# Altium project MIS_Locker.PrjPCB
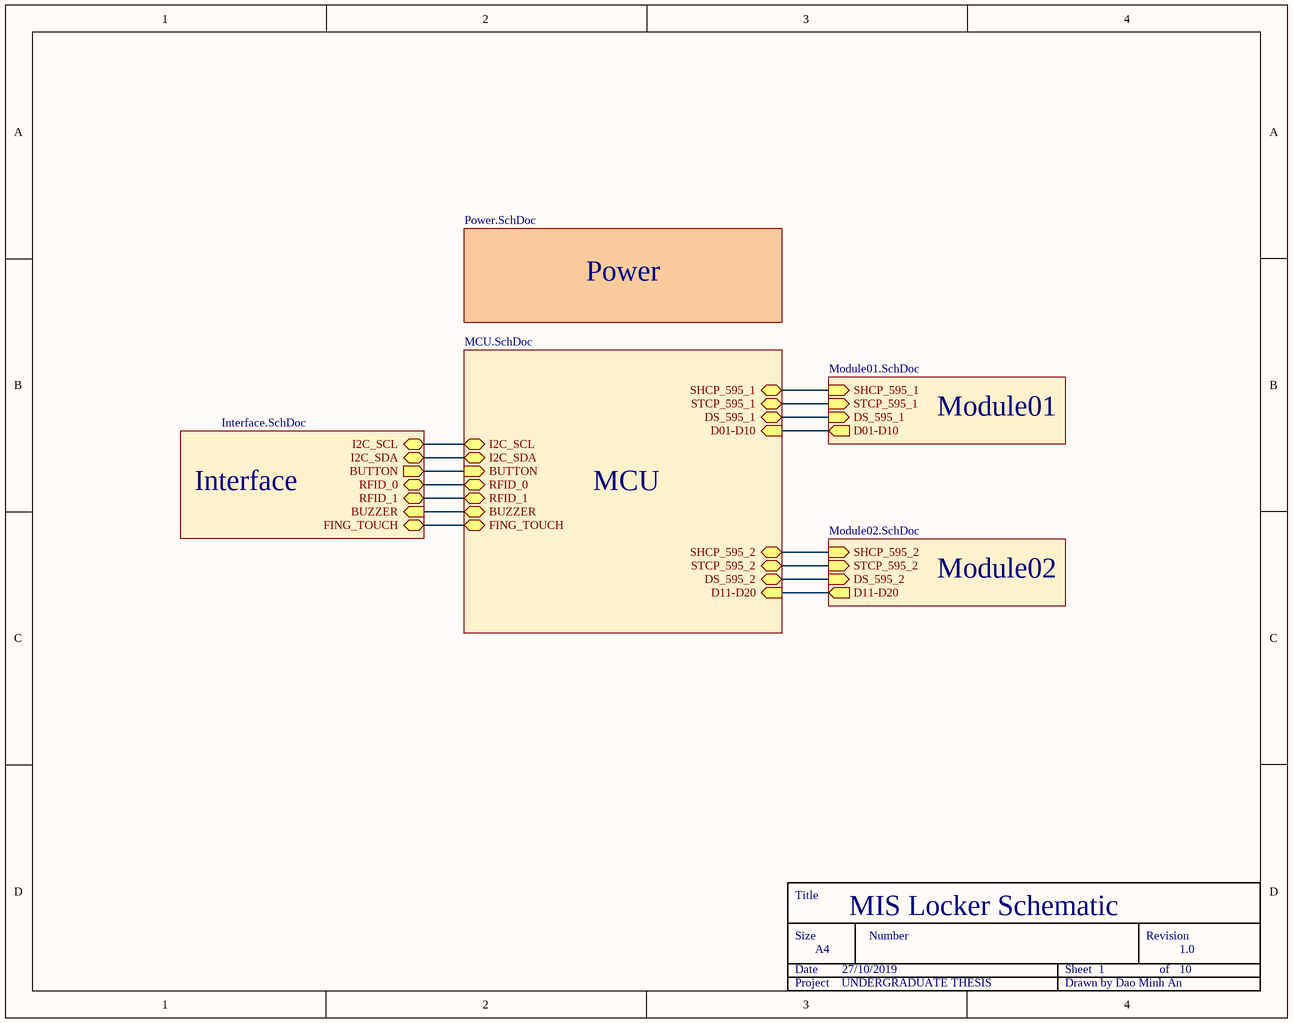
[diagram p0: MIS_Locker.SchDoc]
10 sheets, 356 parts. Net scope: hierarchical (ports join the sheet entries above them; power ports are global).
Board file: MIS_Locker.PcbDoc
Sheets:
  MIS_Locker.SchDoc
    Module01 = Module01.SchDoc
      FETs_M1 = FET_M1.SchDoc
      GPIO_M1 = GPIO_M1.SchDoc
    Power = Power.SchDoc
    Module02 = Module02.SchDoc
      FETs_M2 = FET_M2.SchDoc
      GPIO_M2 = GPIO_M2.SchDoc
    MCU = MCU.SchDoc
    Interface = Interface.SchDoc

## Sheet MIS_Locker.SchDoc: MIS Locker Schematic
size A; Date: 27/10/2019; DrawnBy: Minh-An Dao; Organization: Can Tho University; Revision: 1.0; SheetNumber: 1; SheetTotal: 10

### Parts
T1  Title_Block  (value not drawn)

### Sub-sheets
Interface = Interface.SchDoc: BUTTON (out), I2C_SCL (bidir), I2C_SDA (bidir), RFID_0 (bidir), RFID_1 (bidir), BUZZER (in), FING_TOUCH (bidir)
MCU = MCU.SchDoc: DS_595_2 (bidir), STCP_595_2 (bidir), SHCP_595_2 (bidir), DS_595_1 (bidir), STCP_595_1 (bidir), SHCP_595_1 (bidir), I2C_SCL (bidir), I2C_SDA (bidir), D01-D10 (in), D11-D20 (in), BUTTON (in), BUZZER (bidir), RFID_0 (bidir), RFID_1 (bidir), FING_TOUCH (bidir)
Module01 = Module01.SchDoc: SHCP_595_1 (in), STCP_595_1 (in), DS_595_1 (in), D01-D10 (out)
Module02 = Module02.SchDoc: SHCP_595_2 (in), STCP_595_2 (in), DS_595_2 (in), D11-D20 (out)
Power = Power.SchDoc: no entries

### Nets
1_N: sheet Module01/SHCP_595_1, sheet MCU/SHCP_595_1
1_P: sheet Module01/DS_595_1, sheet MCU/DS_595_1
2_N: sheet Module02/DS_595_2, sheet MCU/DS_595_2
2_P: sheet Module02/SHCP_595_2, sheet MCU/SHCP_595_2
3_N: sheet MCU/RFID_1, sheet Interface/RFID_1
3_P: sheet MCU/RFID_0, sheet Interface/RFID_0
OK: sheet MCU/BUTTON, sheet Interface/BUTTON
Net1_12: sheet Module01/STCP_595_1, sheet MCU/STCP_595_1
Net4_12: sheet Module02/STCP_595_2, sheet MCU/STCP_595_2
Net*1_1: sheet Module01/D01-D10, sheet MCU/D01-D10
Net*81_1: sheet Module02/D11-D20, sheet MCU/D11-D20
NetConverter_1_11: sheet MCU/BUZZER, sheet Interface/BUZZER
NetInterface_Connector_9: sheet MCU/I2C_SDA, sheet Interface/I2C_SDA
NetInterface_Connector_19: sheet MCU/I2C_SCL, sheet Interface/I2C_SCL
NetInterface_Connector_20: sheet MCU/FING_TOUCH, sheet Interface/FING_TOUCH

### Notes on the sheet
- (in symbol Title_Block) Title; Size; Number; Revision; A4; Date; Sheet; of; Project    UNDERGRADUATE THESIS; Drawn by Dao Minh An

## Sheet Module01.SchDoc
size A
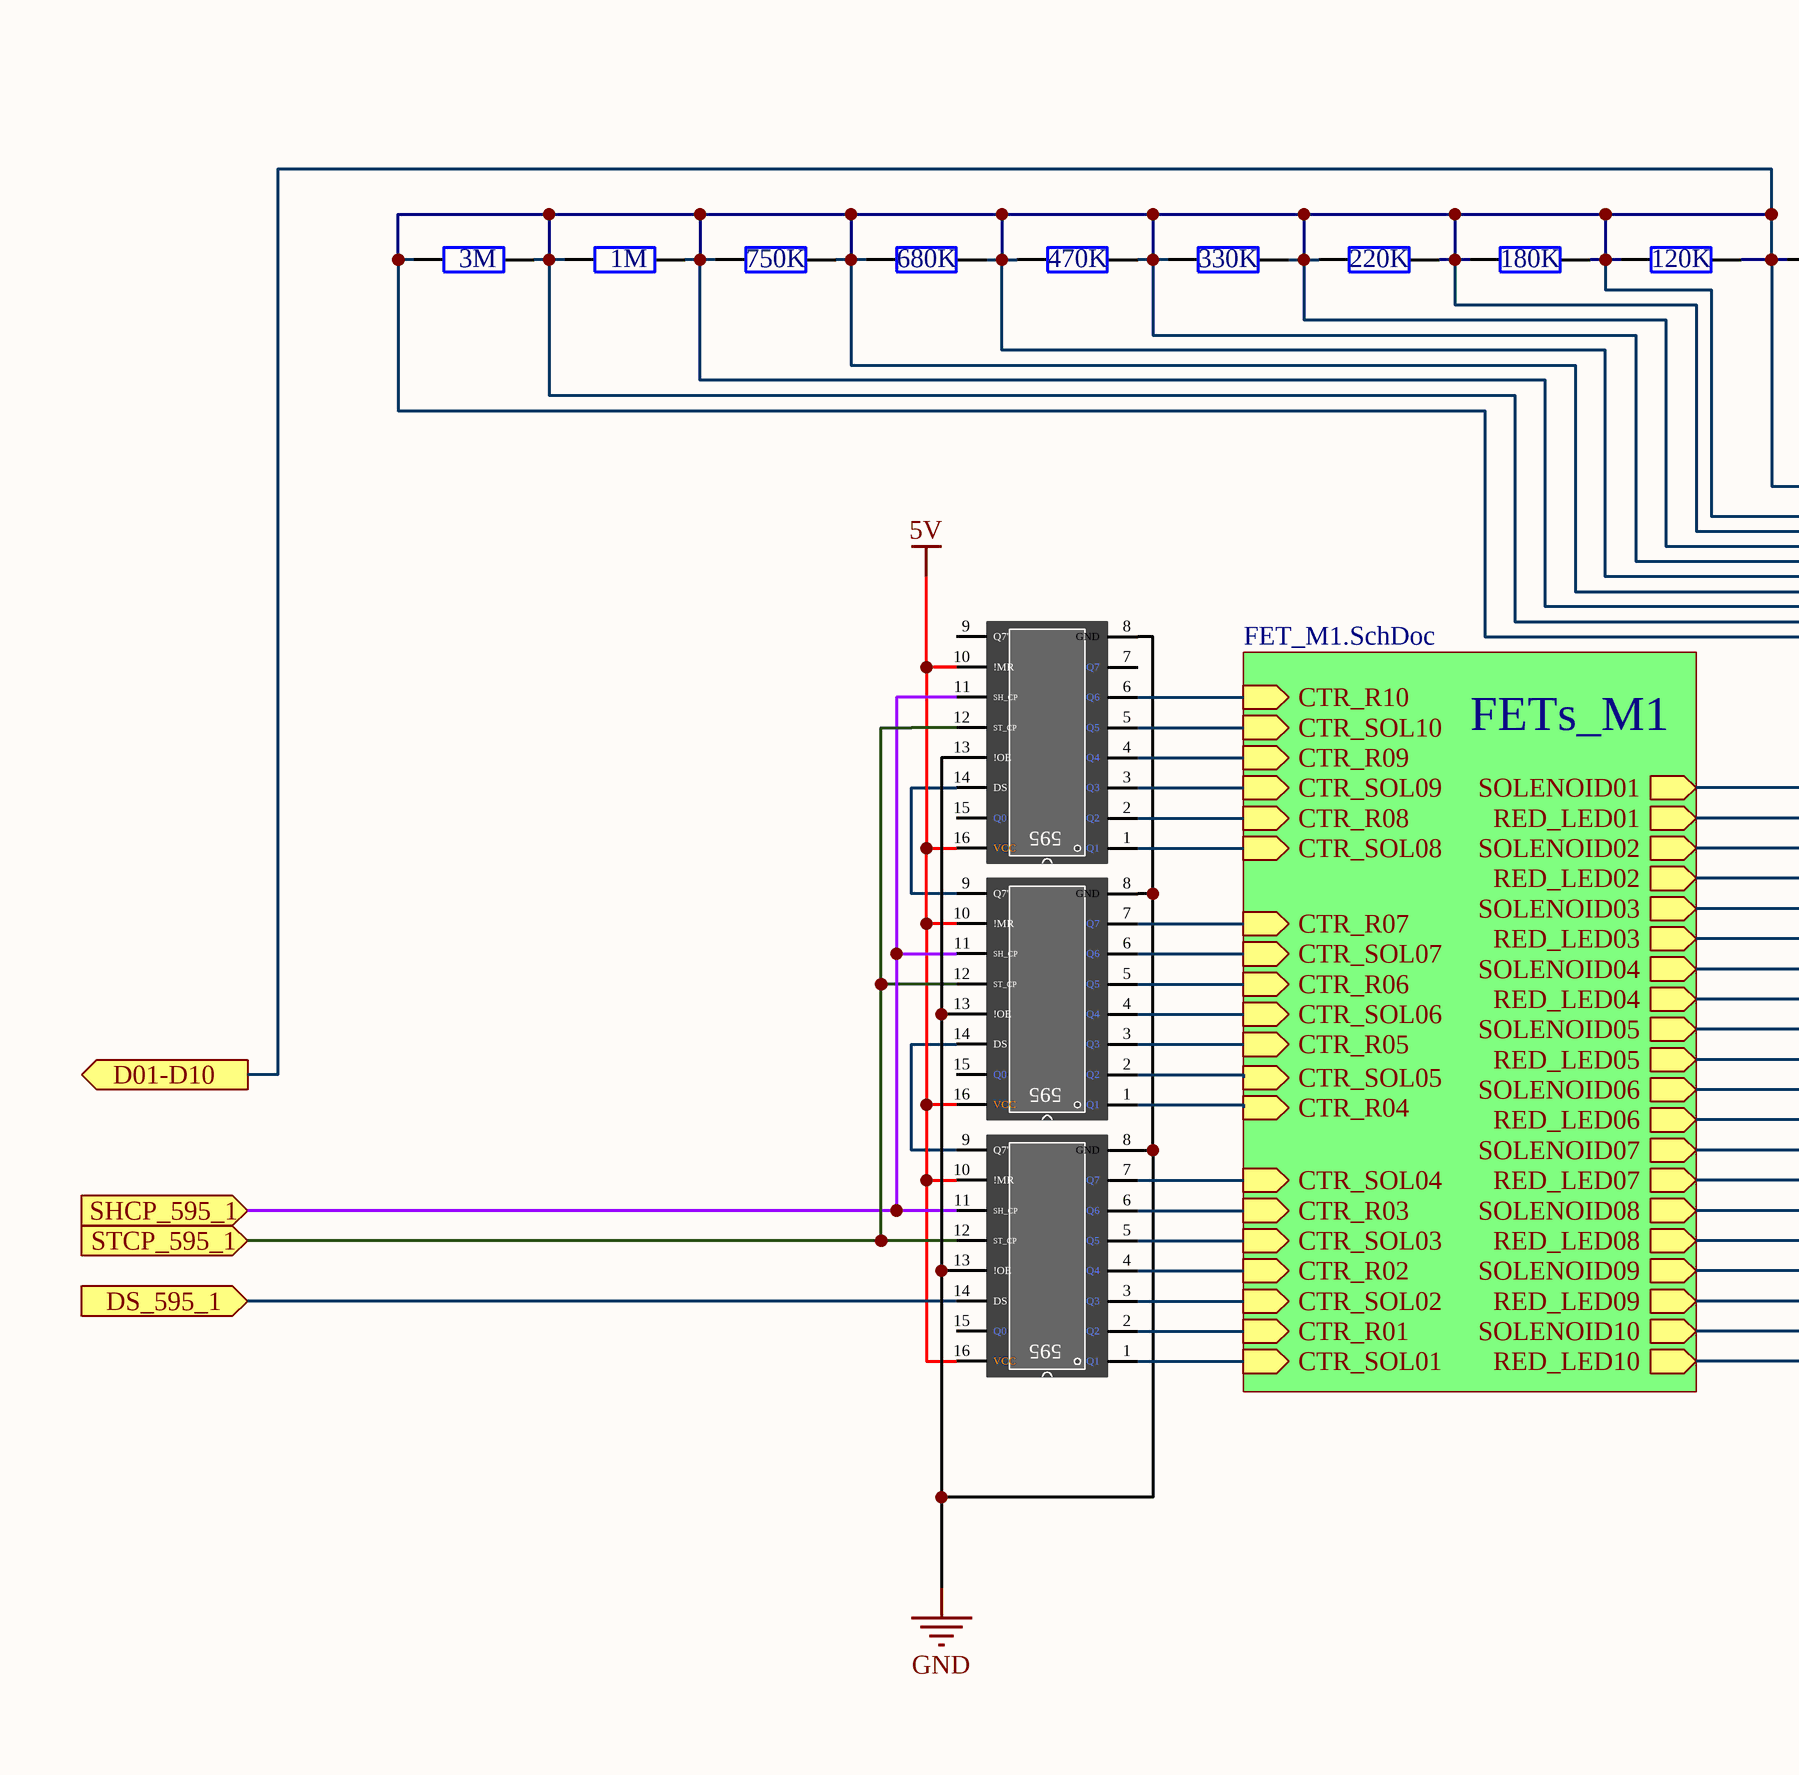
[diagram p1: Module01.SchDoc, left]
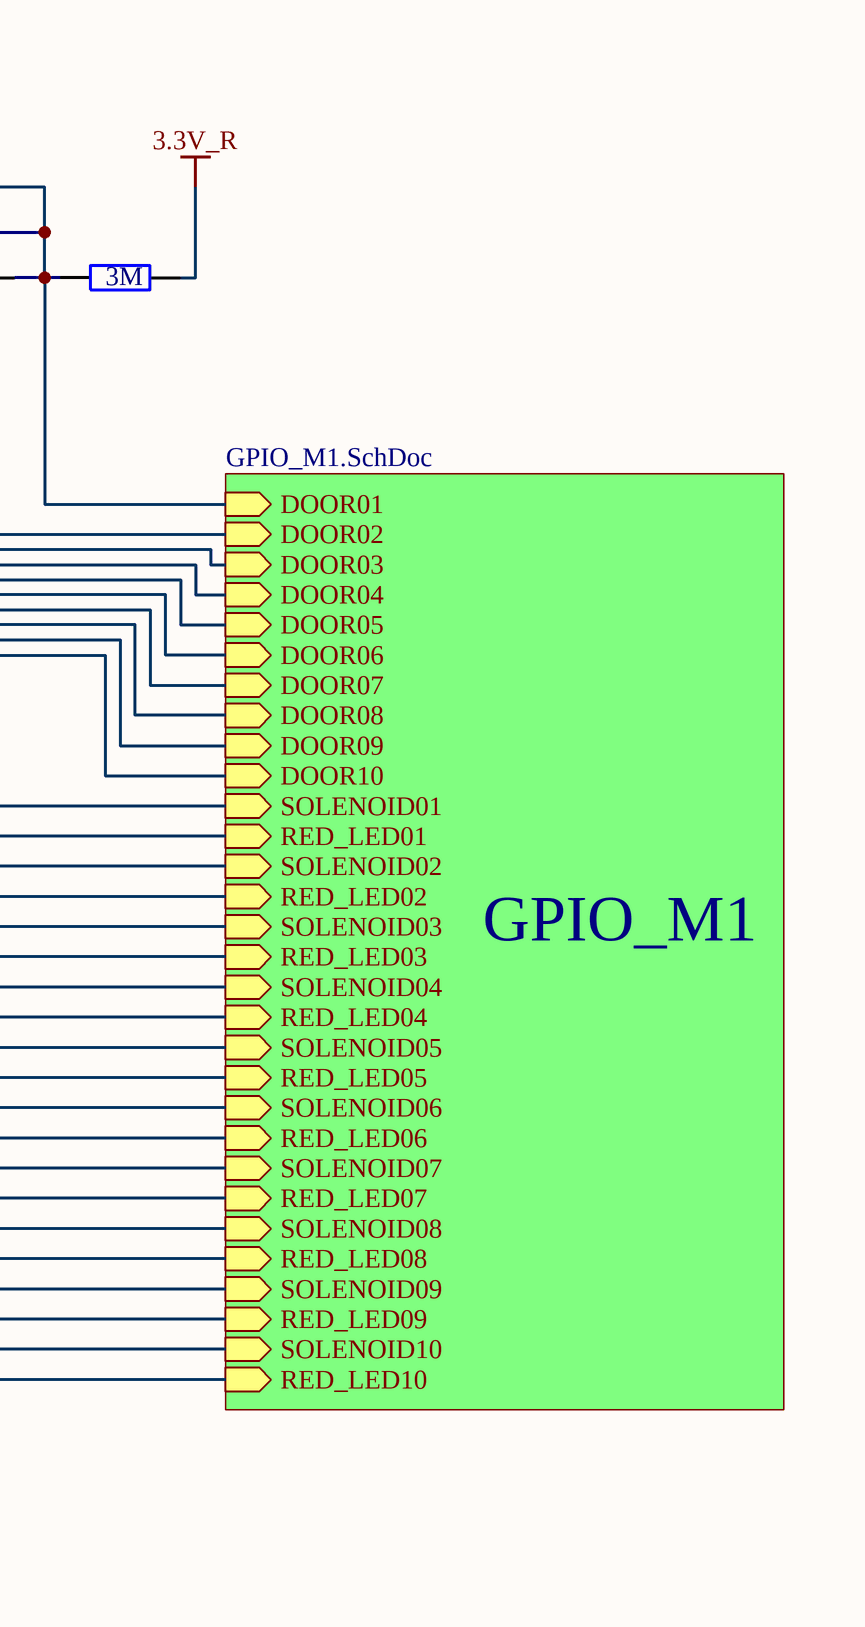
[diagram p2: Module01.SchDoc, right]

### Parts
1  5#HC74595  [5#HC74595]  (value not drawn)
2  5#HC74595  [5#HC74595]  (value not drawn)
3  5#HC74595  [5#HC74595]  (value not drawn)
R1  3M  [AXIAL-0.4]
R2  1M  [AXIAL-0.4]
R3  750K  [AXIAL-0.4]
R4  680K  [AXIAL-0.4]
R5  470K  [AXIAL-0.4]
R6  330K  [AXIAL-0.4]
R7  220K  [AXIAL-0.4]
R8  180K  [AXIAL-0.4]
R9  120K  [AXIAL-0.4]
R10  3M  [AXIAL-0.4]

### Sub-sheets
FETs_M1 = FET_M1.SchDoc: CTR_SOL01 (in), CTR_R01 (in), SOLENOID01 (out), RED_LED01 (out), CTR_SOL04 (in), CTR_R04 (in), SOLENOID04 (out), RED_LED04 (out), CTR_SOL07 (in), CTR_R07 (in), SOLENOID07 (out), RED_LED07 (out), CTR_SOL09 (in), CTR_R09 (in), SOLENOID09 (out), RED_LED09 (out), CTR_SOL02 (in), CTR_R02 (in), SOLENOID02 (out), RED_LED02 (out), CTR_SOL05 (in), CTR_R05 (in), SOLENOID05 (out), RED_LED05 (out), CTR_SOL08 (in), CTR_R08 (in), SOLENOID08 (out), RED_LED08 (out), CTR_SOL10 (in), CTR_R10 (in), SOLENOID10 (out), RED_LED10 (out), CTR_SOL03 (in), CTR_R03 (in), SOLENOID03 (out), RED_LED03 (out), CTR_SOL06 (in), CTR_R06 (in), SOLENOID06 (out), RED_LED06 (out)
GPIO_M1 = GPIO_M1.SchDoc: DOOR01 (in), DOOR02 (in), DOOR03 (in), DOOR04 (in), DOOR05 (in), SOLENOID01 (in), RED_LED01 (in), SOLENOID02 (in), RED_LED02 (in), SOLENOID03 (in), RED_LED03 (in), SOLENOID04 (in), RED_LED04 (in), SOLENOID05 (in), RED_LED05 (in), DOOR06 (in), DOOR07 (in), DOOR08 (in), DOOR09 (in), DOOR10 (in), SOLENOID06 (in), RED_LED06 (in), SOLENOID07 (in), RED_LED07 (in), SOLENOID08 (in), RED_LED08 (in), SOLENOID09 (in), RED_LED09 (in), SOLENOID10 (in), RED_LED10 (in)

### Ports
D01-D10 (out), DS_595_1 (in), SHCP_595_1 (in), STCP_595_1 (in)

### Nets
3.3V_R: R10.1
5V: 1.10(!MR) 1.16(VCC) 2.10(!MR) 2.16(VCC) 3.10(!MR) 3.16(VCC)
GND: 1.8(GND) 1.13(!OE) 2.8(GND) 2.13(!OE) 3.8(GND) 3.13(!OE)
1_N: 1.11(SH_CP) 2.11(SH_CP) 3.11(SH_CP) ; port SHCP_595_1
1_P: 1.14(DS) ; port DS_595_1
SOLENOID01: sheet FETs_M1/SOLENOID01, sheet GPIO_M1/SOLENOID01
SOLENOID02: sheet FETs_M1/SOLENOID02, sheet GPIO_M1/SOLENOID02
SOLENOID03: sheet FETs_M1/SOLENOID03, sheet GPIO_M1/SOLENOID03
SOLENOID04: sheet FETs_M1/SOLENOID04, sheet GPIO_M1/SOLENOID04
SOLENOID05: sheet FETs_M1/SOLENOID05, sheet GPIO_M1/SOLENOID05
SOLENOID06: sheet FETs_M1/SOLENOID06, sheet GPIO_M1/SOLENOID06
SOLENOID07: sheet FETs_M1/SOLENOID07, sheet GPIO_M1/SOLENOID07
SOLENOID08: sheet FETs_M1/SOLENOID08, sheet GPIO_M1/SOLENOID08
SOLENOID09: sheet FETs_M1/SOLENOID09, sheet GPIO_M1/SOLENOID09
SOLENOID10: sheet FETs_M1/SOLENOID10, sheet GPIO_M1/SOLENOID10
Net1_1: 1.1(Q1) ; sheet FETs_M1/CTR_SOL01
Net1_2: 1.2(Q2) ; sheet FETs_M1/CTR_R01
Net1_3: 1.3(Q3) ; sheet FETs_M1/CTR_SOL02
Net1_4: 1.4(Q4) ; sheet FETs_M1/CTR_R02
Net1_5: 1.5(Q5) ; sheet FETs_M1/CTR_SOL03
Net1_6: 1.6(Q6) ; sheet FETs_M1/CTR_R03
Net1_7: 1.7(Q7) ; sheet FETs_M1/CTR_SOL04
Net1_9: 1.9(Q7') 2.14(DS)
Net1_12: 1.12(ST_CP) 2.12(ST_CP) 3.12(ST_CP) ; port STCP_595_1
Net2_1: 2.1(Q1) ; sheet FETs_M1/CTR_R04
Net2_2: 2.2(Q2) ; sheet FETs_M1/CTR_SOL05
Net2_3: 2.3(Q3) ; sheet FETs_M1/CTR_R05
Net2_4: 2.4(Q4) ; sheet FETs_M1/CTR_SOL06
Net2_5: 2.5(Q5) ; sheet FETs_M1/CTR_R06
Net2_6: 2.6(Q6) ; sheet FETs_M1/CTR_SOL07
Net2_7: 2.7(Q7) ; sheet FETs_M1/CTR_R07
Net2_9: 2.9(Q7') 3.14(DS)
Net3_1: 3.1(Q1) ; sheet FETs_M1/CTR_SOL08
Net3_2: 3.2(Q2) ; sheet FETs_M1/CTR_R08
Net3_3: 3.3(Q3) ; sheet FETs_M1/CTR_SOL09
Net3_4: 3.4(Q4) ; sheet FETs_M1/CTR_R09
Net3_5: 3.5(Q5) ; sheet FETs_M1/CTR_SOL10
Net3_6: 3.6(Q6) ; sheet FETs_M1/CTR_R10
Net*1_1: R1.1 R1.2 R2.1 R2.2 R3.1 R3.2 R4.1 R4.2 R5.1 R5.2 R6.1 R6.2 R7.1 R7.2 R8.1 R8.2 R9.1 R9.2 R10.2 ; port D01-D10, sheet GPIO_M1/DOOR01, sheet GPIO_M1/DOOR02, sheet GPIO_M1/DOOR03, sheet GPIO_M1/DOOR04, sheet GPIO_M1/DOOR05, sheet GPIO_M1/DOOR06, sheet GPIO_M1/DOOR07, sheet GPIO_M1/DOOR08, sheet GPIO_M1/DOOR09, sheet GPIO_M1/DOOR10
Net*31_1: sheet FETs_M1/RED_LED01, sheet GPIO_M1/RED_LED01
Net*32_1: sheet FETs_M1/RED_LED06, sheet GPIO_M1/RED_LED06
Net*43_1: sheet FETs_M1/RED_LED02, sheet GPIO_M1/RED_LED02
Net*44_1: sheet FETs_M1/RED_LED07, sheet GPIO_M1/RED_LED07
Net*55_1: sheet FETs_M1/RED_LED03, sheet GPIO_M1/RED_LED03
Net*56_1: sheet FETs_M1/RED_LED08, sheet GPIO_M1/RED_LED08
Net*67_1: sheet FETs_M1/RED_LED04, sheet GPIO_M1/RED_LED04
Net*68_1: sheet FETs_M1/RED_LED09, sheet GPIO_M1/RED_LED09
Net*79_1: sheet FETs_M1/RED_LED05, sheet GPIO_M1/RED_LED05
Net*80_1: sheet FETs_M1/RED_LED10, sheet GPIO_M1/RED_LED10

Not connected (* = marked no-connect by the designer): 1 15(Q0); 2 15(Q0); 3 7(Q7) 9(Q7') 15(Q0)

### Notes on the sheet
- (in symbol 5#HC74595) 595

### Library data of the parts
R1-R10 = Res2: Resistor; Published: 8-Jun-2000; LatestRevisionDate: 17-Jul-2002; LatestRevisionNote: Re-released for DXP Platform.; PackageReference: AXIAL-0.4; Publisher: Altium Limited; PackageDescription: Axial Device, Thru-Hole; 2 Leads; 0.4 in Pin Spacing

## Sheet FET_M1.SchDoc
size A
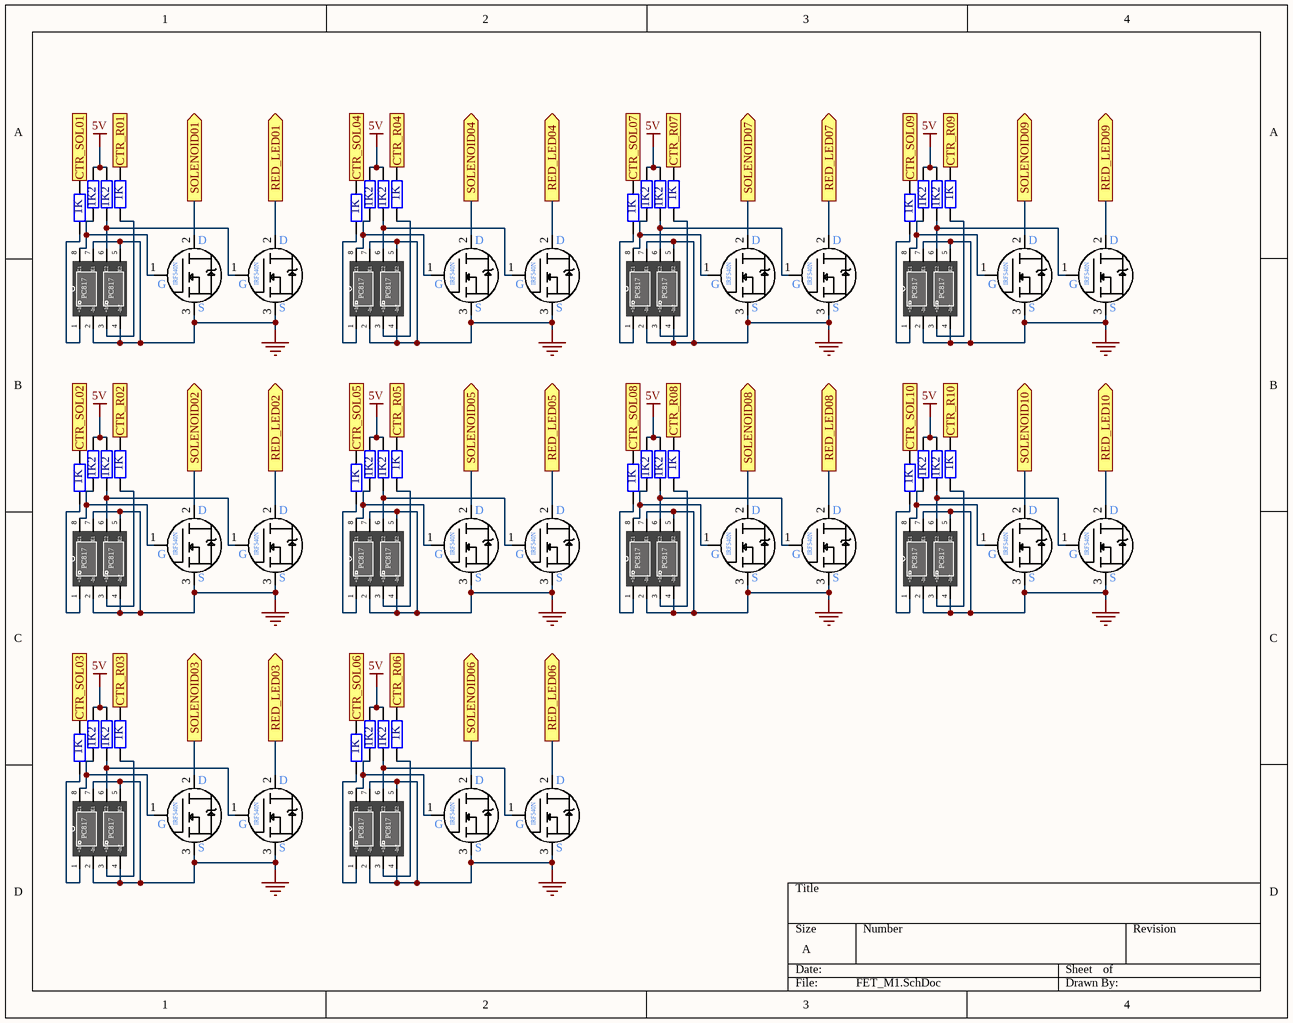
[diagram p3: FET_M1.SchDoc]

### Parts
FET1  5#IRF540N  [5#IRF540N]  (value not drawn)
FET2  5#IRF540N  [5#IRF540N]  (value not drawn)
FET3  5#IRF540N  [5#IRF540N]  (value not drawn)
FET4  5#IRF540N  [5#IRF540N]  (value not drawn)
FET5  5#IRF540N  [5#IRF540N]  (value not drawn)
FET6  5#IRF540N  [5#IRF540N]  (value not drawn)
FET7  5#IRF540N  [5#IRF540N]  (value not drawn)
FET8  5#IRF540N  [5#IRF540N]  (value not drawn)
FET9  5#IRF540N  [5#IRF540N]  (value not drawn)
FET10  5#IRF540N  [5#IRF540N]  (value not drawn)
FET11  5#IRF540N  [5#IRF540N]  (value not drawn)
FET12  5#IRF540N  [5#IRF540N]  (value not drawn)
FET13  5#IRF540N  [5#IRF540N]  (value not drawn)
FET14  5#IRF540N  [5#IRF540N]  (value not drawn)
FET15  5#IRF540N  [5#IRF540N]  (value not drawn)
FET16  5#IRF540N  [5#IRF540N]  (value not drawn)
FET17  5#IRF540N  [5#IRF540N]  (value not drawn)
FET18  5#IRF540N  [5#IRF540N]  (value not drawn)
FET19  5#IRF540N  [5#IRF540N]  (value not drawn)
FET20  5#IRF540N  [5#IRF540N]  (value not drawn)
PC1  5#Dip8_PC817x2  [5#Dip8_PC817x2]  (value not drawn)
PC2  5#Dip8_PC817x2  [5#Dip8_PC817x2]  (value not drawn)
PC3  5#Dip8_PC817x2  [5#Dip8_PC817x2]  (value not drawn)
PC4  5#Dip8_PC817x2  [5#Dip8_PC817x2]  (value not drawn)
PC5  5#Dip8_PC817x2  [5#Dip8_PC817x2]  (value not drawn)
PC6  5#Dip8_PC817x2  [5#Dip8_PC817x2]  (value not drawn)
PC7  5#Dip8_PC817x2  [5#Dip8_PC817x2]  (value not drawn)
PC8  5#Dip8_PC817x2  [5#Dip8_PC817x2]  (value not drawn)
PC9  5#Dip8_PC817x2  [5#Dip8_PC817x2]  (value not drawn)
PC10  5#Dip8_PC817x2  [5#Dip8_PC817x2]  (value not drawn)
R18  1K  [AXIAL-0.4]
R19  1K2  [AXIAL-0.4]
R20  1K  [AXIAL-0.4]
R21  1K2  [AXIAL-0.4]
R22  1K  [AXIAL-0.4]
R23  1K2  [AXIAL-0.4]
R24  1K  [AXIAL-0.4]
R25  1K2  [AXIAL-0.4]
R26  1K  [AXIAL-0.4]
R27  1K2  [AXIAL-0.4]
R28  1K  [AXIAL-0.4]
R29  1K2  [AXIAL-0.4]
R30  1K  [AXIAL-0.4]
R31  1K2  [AXIAL-0.4]
R32  1K  [AXIAL-0.4]
R33  1K2  [AXIAL-0.4]
R34  1K  [AXIAL-0.4]
R35  1K2  [AXIAL-0.4]
R36  1K  [AXIAL-0.4]
R37  1K2  [AXIAL-0.4]
R38  1K  [AXIAL-0.4]
R39  1K2  [AXIAL-0.4]
R40  1K  [AXIAL-0.4]
R41  1K2  [AXIAL-0.4]
R42  1K  [AXIAL-0.4]
R43  1K2  [AXIAL-0.4]
R44  1K  [AXIAL-0.4]
R45  1K2  [AXIAL-0.4]
R46  1K  [AXIAL-0.4]
R47  1K2  [AXIAL-0.4]
R48  1K  [AXIAL-0.4]
R49  1K2  [AXIAL-0.4]
R50  1K  [AXIAL-0.4]
R51  1K2  [AXIAL-0.4]
R52  1K  [AXIAL-0.4]
R53  1K2  [AXIAL-0.4]
R54  1K  [AXIAL-0.4]
R55  1K2  [AXIAL-0.4]
R56  1K  [AXIAL-0.4]
R57  1K2  [AXIAL-0.4]

### Ports
CTR_R01 (in), CTR_R02 (in), CTR_R03 (in), CTR_R04 (in), CTR_R05 (in), CTR_R06 (in), CTR_R07 (in), CTR_R08 (in), CTR_R09 (in), CTR_R10 (in), CTR_SOL01 (in), CTR_SOL02 (in), CTR_SOL03 (in), CTR_SOL04 (in), CTR_SOL05 (in), CTR_SOL06 (in), CTR_SOL07 (in), CTR_SOL08 (in), CTR_SOL09 (in), CTR_SOL10 (in), RED_LED01 (out), RED_LED02 (out), RED_LED03 (out), RED_LED04 (out), RED_LED05 (out), RED_LED06 (out), RED_LED07 (out), RED_LED08 (out), RED_LED09 (out), RED_LED10 (out), SOLENOID01 (out), SOLENOID02 (out), SOLENOID03 (out), SOLENOID04 (out), SOLENOID05 (out), SOLENOID06 (out), SOLENOID07 (out), SOLENOID08 (out), SOLENOID09 (out), SOLENOID10 (out)

### Nets
5V: R19.2 R21.2 R23.2 R25.2 R27.2 R29.2 R31.2 R33.2 R35.2 R37.2 R39.2 R41.2 R43.2 R45.2 R47.2 R49.2 R51.2 R53.2 R55.2 R57.2
GND: FET1.3(S) FET2.3(S) FET3.3(S) FET4.3(S) FET5.3(S) FET6.3(S) FET7.3(S) FET8.3(S) FET9.3(S) FET10.3(S) FET11.3(S) FET12.3(S) FET13.3(S) FET14.3(S) FET15.3(S) FET16.3(S) FET17.3(S) FET18.3(S) FET19.3(S) FET20.3(S) PC1.2(-In1) PC1.4(-In2) PC1.5(E2) PC1.7(E1) PC2.2(-In1) PC2.4(-In2) PC2.5(E2) PC2.7(E1) PC3.2(-In1) PC3.4(-In2) PC3.5(E2) PC3.7(E1) PC4.2(-In1) PC4.4(-In2) PC4.5(E2) PC4.7(E1) PC5.2(-In1) PC5.4(-In2) PC5.5(E2) PC5.7(E1) PC6.2(-In1) PC6.4(-In2) PC6.5(E2) PC6.7(E1) PC7.2(-In1) PC7.4(-In2) PC7.5(E2) PC7.7(E1) PC8.2(-In1) PC8.4(-In2) PC8.5(E2) PC8.7(E1) PC9.2(-In1) PC9.4(-In2) PC9.5(E2) PC9.7(E1) PC10.2(-In1) PC10.4(-In2) PC10.5(E2) PC10.7(E1)
SOLENOID01: FET1.2(D) ; port SOLENOID01
SOLENOID02: FET3.2(D) ; port SOLENOID02
SOLENOID03: FET5.2(D) ; port SOLENOID03
SOLENOID04: FET7.2(D) ; port SOLENOID04
SOLENOID05: FET9.2(D) ; port SOLENOID05
SOLENOID06: FET11.2(D) ; port SOLENOID06
SOLENOID07: FET13.2(D) ; port SOLENOID07
SOLENOID08: FET15.2(D) ; port SOLENOID08
SOLENOID09: FET17.2(D) ; port SOLENOID09
SOLENOID10: FET19.2(D) ; port SOLENOID10
Net1_1: R18.1 ; port CTR_SOL01
Net1_2: R26.1 ; port CTR_R01
Net1_3: R20.1 ; port CTR_SOL02
Net1_4: R28.1 ; port CTR_R02
Net1_5: R22.1 ; port CTR_SOL03
Net1_6: R30.1 ; port CTR_R03
Net1_7: R24.1 ; port CTR_SOL04
Net2_1: R32.1 ; port CTR_R04
Net2_2: R34.1 ; port CTR_SOL05
Net2_3: R42.1 ; port CTR_R05
Net2_4: R36.1 ; port CTR_SOL06
Net2_5: R44.1 ; port CTR_R06
Net2_6: R38.1 ; port CTR_SOL07
Net2_7: R46.1 ; port CTR_R07
Net3_1: R40.1 ; port CTR_SOL08
Net3_2: R48.1 ; port CTR_R08
Net3_3: R50.1 ; port CTR_SOL09
Net3_4: R54.1 ; port CTR_R09
Net3_5: R52.1 ; port CTR_SOL10
Net3_6: R56.1 ; port CTR_R10
Net*31_1: FET2.2(D) ; port RED_LED01
Net*32_1: FET12.2(D) ; port RED_LED06
Net*43_1: FET4.2(D) ; port RED_LED02
Net*44_1: FET14.2(D) ; port RED_LED07
Net*55_1: FET6.2(D) ; port RED_LED03
Net*56_1: FET16.2(D) ; port RED_LED08
Net*67_1: FET8.2(D) ; port RED_LED04
Net*68_1: FET18.2(D) ; port RED_LED09
Net*79_1: FET10.2(D) ; port RED_LED05
Net*80_1: FET20.2(D) ; port RED_LED10
NetFET1_1: FET1.1(G) PC1.8(C1) R19.1
NetFET2_1: FET2.1(G) PC1.6(C2) R27.1
NetFET3_1: FET3.1(G) PC2.8(C1) R21.1
NetFET4_1: FET4.1(G) PC2.6(C2) R29.1
NetFET5_1: FET5.1(G) PC3.8(C1) R23.1
NetFET6_1: FET6.1(G) PC3.6(C2) R31.1
NetFET7_1: FET7.1(G) PC4.8(C1) R25.1
NetFET8_1: FET8.1(G) PC4.6(C2) R33.1
NetFET9_1: FET9.1(G) PC5.8(C1) R35.1
NetFET10_1: FET10.1(G) PC5.6(C2) R43.1
NetFET11_1: FET11.1(G) PC6.8(C1) R37.1
NetFET12_1: FET12.1(G) PC6.6(C2) R45.1
NetFET13_1: FET13.1(G) PC7.8(C1) R39.1
NetFET14_1: FET14.1(G) PC7.6(C2) R47.1
NetFET15_1: FET15.1(G) PC8.8(C1) R41.1
NetFET16_1: FET16.1(G) PC8.6(C2) R49.1
NetFET17_1: FET17.1(G) PC9.8(C1) R51.1
NetFET18_1: FET18.1(G) PC9.6(C2) R55.1
NetFET19_1: FET19.1(G) PC10.8(C1) R53.1
NetFET20_1: FET20.1(G) PC10.6(C2) R57.1
NetPC1_1: PC1.1(+In1) R18.2
NetPC1_3: PC1.3(+In2) R26.2
NetPC2_1: PC2.1(+In1) R20.2
NetPC2_3: PC2.3(+In2) R28.2
NetPC3_1: PC3.1(+In1) R22.2
NetPC3_3: PC3.3(+In2) R30.2
NetPC4_1: PC4.1(+In1) R24.2
NetPC4_3: PC4.3(+In2) R32.2
NetPC5_1: PC5.1(+In1) R34.2
NetPC5_3: PC5.3(+In2) R42.2
NetPC6_1: PC6.1(+In1) R36.2
NetPC6_3: PC6.3(+In2) R44.2
NetPC7_1: PC7.1(+In1) R38.2
NetPC7_3: PC7.3(+In2) R46.2
NetPC8_1: PC8.1(+In1) R40.2
NetPC8_3: PC8.3(+In2) R48.2
NetPC9_1: PC9.1(+In1) R50.2
NetPC9_3: PC9.3(+In2) R54.2
NetPC10_1: PC10.1(+In1) R52.2
NetPC10_3: PC10.3(+In2) R56.2

### Notes on the sheet
- (in symbol 5#Dip8_PC817x2) PC817
- (in symbol 5#IRF540N) IRF540N

### Library data of the parts
R18-R57 = Res2: Resistor; Published: 8-Jun-2000; LatestRevisionDate: 17-Jul-2002; LatestRevisionNote: Re-released for DXP Platform.; PackageReference: AXIAL-0.4; Publisher: Altium Limited; PackageDescription: Axial Device, Thru-Hole; 2 Leads; 0.4 in Pin Spacing

## Sheet GPIO_M1.SchDoc
size A4
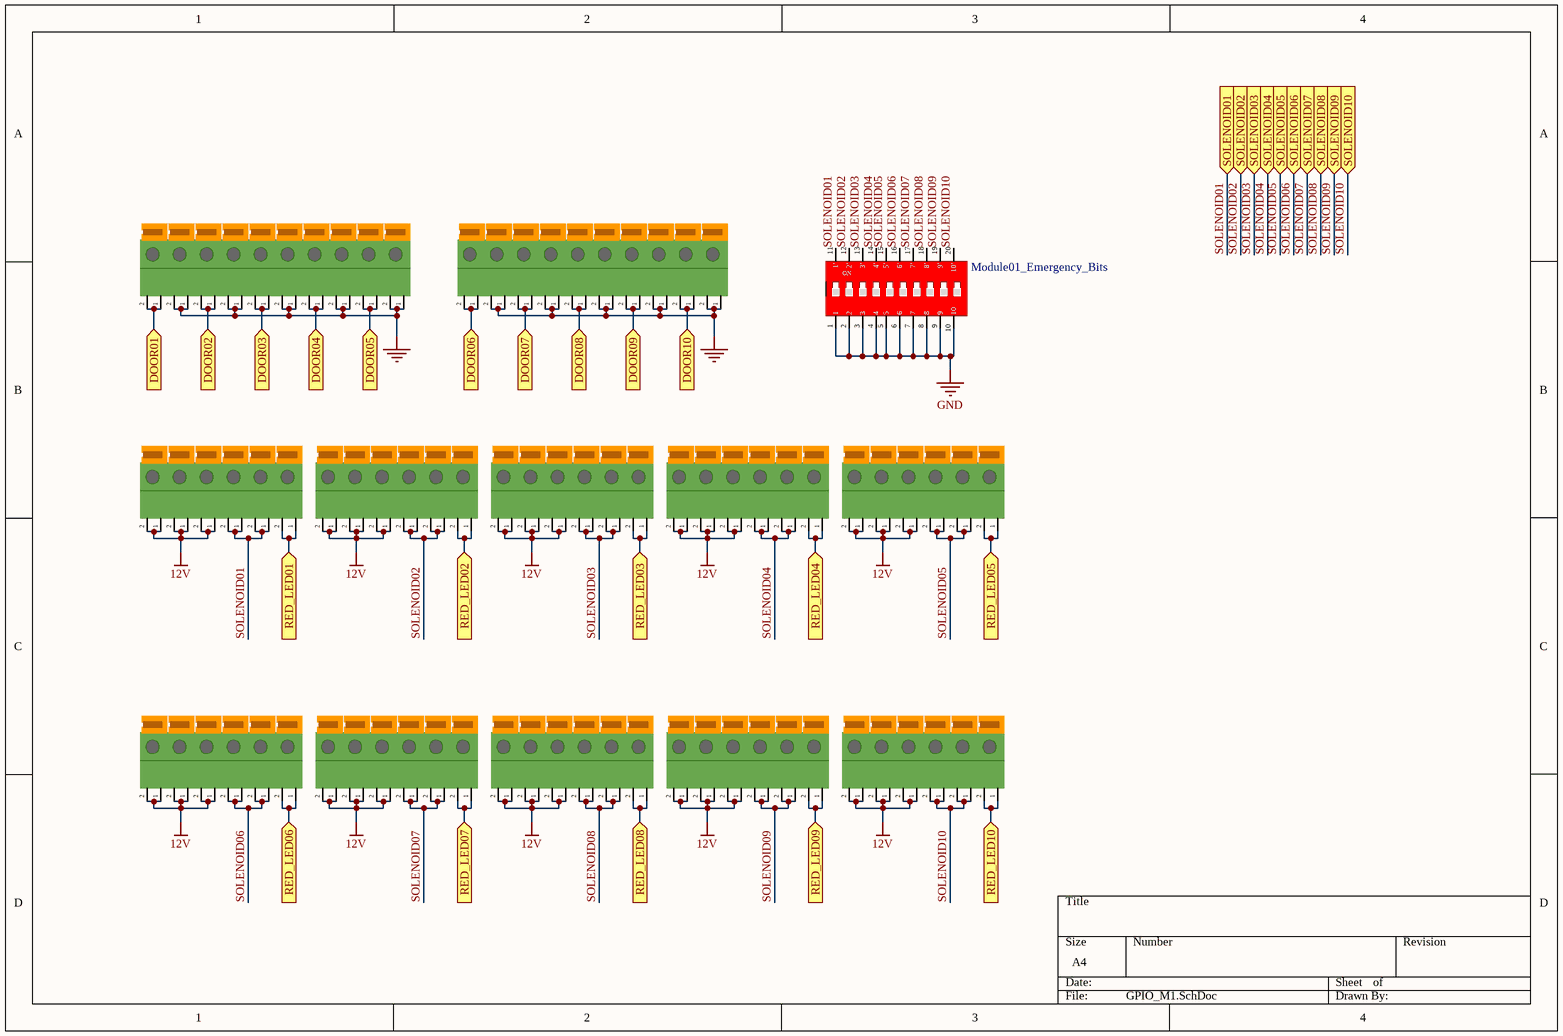
[diagram p4: GPIO_M1.SchDoc]

### Parts
*1  D01  [5#Terminalx1]  (value not drawn)
*2  D06  [5#Terminalx1]  (value not drawn)
*3  GND  [5#Terminalx1]  (value not drawn)
*4  GND  [5#Terminalx1]  (value not drawn)
*5  D02  [5#Terminalx1]  (value not drawn)
*6  D07  [5#Terminalx1]  (value not drawn)
*7  GND  [5#Terminalx1]  (value not drawn)
*8  GND  [5#Terminalx1]  (value not drawn)
*9  D03  [5#Terminalx1]  (value not drawn)
*10  D08  [5#Terminalx1]  (value not drawn)
*11  GND  [5#Terminalx1]  (value not drawn)
*12  GND  [5#Terminalx1]  (value not drawn)
*13  D04  [5#Terminalx1]  (value not drawn)
*14  D09  [5#Terminalx1]  (value not drawn)
*15  GND  [5#Terminalx1]  (value not drawn)
*16  GND  [5#Terminalx1]  (value not drawn)
*17  D05  [5#Terminalx1]  (value not drawn)
*18  D10  [5#Terminalx1]  (value not drawn)
*19  GND  [5#Terminalx1]  (value not drawn)
*20  GND  [5#Terminalx1]  (value not drawn)
*21  12V  [5#Terminalx1]  (value not drawn)
*22  12V  [5#Terminalx1]  (value not drawn)
*23  12V  [5#Terminalx1]  (value not drawn)
*24  12V  [5#Terminalx1]  (value not drawn)
*25  12V  [5#Terminalx1]  (value not drawn)
*26  12V  [5#Terminalx1]  (value not drawn)
*27  S01  [5#Terminalx1]  (value not drawn)
*28  S06  [5#Terminalx1]  (value not drawn)
*29  G01  [5#Terminalx1]  (value not drawn)
*30  G06  [5#Terminalx1]  (value not drawn)
*31  R01  [5#Terminalx1]  (value not drawn)
*32  R06  [5#Terminalx1]  (value not drawn)
*33  12V  [5#Terminalx1]  (value not drawn)
*34  12V  [5#Terminalx1]  (value not drawn)
*35  12V  [5#Terminalx1]  (value not drawn)
*36  12V  [5#Terminalx1]  (value not drawn)
*37  12V  [5#Terminalx1]  (value not drawn)
*38  12V  [5#Terminalx1]  (value not drawn)
*39  S02  [5#Terminalx1]  (value not drawn)
*40  S07  [5#Terminalx1]  (value not drawn)
*41  G02  [5#Terminalx1]  (value not drawn)
*42  G07  [5#Terminalx1]  (value not drawn)
*43  R02  [5#Terminalx1]  (value not drawn)
*44  R07  [5#Terminalx1]  (value not drawn)
*45  12V  [5#Terminalx1]  (value not drawn)
*46  12V  [5#Terminalx1]  (value not drawn)
*47  12V  [5#Terminalx1]  (value not drawn)
*48  12V  [5#Terminalx1]  (value not drawn)
*49  12V  [5#Terminalx1]  (value not drawn)
*50  12V  [5#Terminalx1]  (value not drawn)
*51  S03  [5#Terminalx1]  (value not drawn)
*52  S08  [5#Terminalx1]  (value not drawn)
*53  G03  [5#Terminalx1]  (value not drawn)
*54  G08  [5#Terminalx1]  (value not drawn)
*55  R03  [5#Terminalx1]  (value not drawn)
*56  R08  [5#Terminalx1]  (value not drawn)
*57  12V  [5#Terminalx1]  (value not drawn)
*58  12V  [5#Terminalx1]  (value not drawn)
*59  12V  [5#Terminalx1]  (value not drawn)
*60  12V  [5#Terminalx1]  (value not drawn)
*61  12V  [5#Terminalx1]  (value not drawn)
*62  12V  [5#Terminalx1]  (value not drawn)
*63  S04  [5#Terminalx1]  (value not drawn)
*64  S09  [5#Terminalx1]  (value not drawn)
*65  G04  [5#Terminalx1]  (value not drawn)
*66  G09  [5#Terminalx1]  (value not drawn)
*67  R04  [5#Terminalx1]  (value not drawn)
*68  R09  [5#Terminalx1]  (value not drawn)
*69  12V  [5#Terminalx1]  (value not drawn)
*70  12V  [5#Terminalx1]  (value not drawn)
*71  12V  [5#Terminalx1]  (value not drawn)
*72  12V  [5#Terminalx1]  (value not drawn)
*73  12V  [5#Terminalx1]  (value not drawn)
*74  12V  [5#Terminalx1]  (value not drawn)
*75  S05  [5#Terminalx1]  (value not drawn)
*76  S10  [5#Terminalx1]  (value not drawn)
*77  G05  [5#Terminalx1]  (value not drawn)
*78  G10  [5#Terminalx1]  (value not drawn)
*79  R05  [5#Terminalx1]  (value not drawn)
*80  R10  [5#Terminalx1]  (value not drawn)
Bit1  Module01_Emergency_Bits  [6#Bit_Switch_10]

### Ports
DOOR01 (in), DOOR02 (in), DOOR03 (in), DOOR04 (in), DOOR05 (in), DOOR06 (in), DOOR07 (in), DOOR08 (in), DOOR09 (in), DOOR10 (in), RED_LED01 (in), RED_LED02 (in), RED_LED03 (in), RED_LED04 (in), RED_LED05 (in), RED_LED06 (in), RED_LED07 (in), RED_LED08 (in), RED_LED09 (in), RED_LED10 (in), SOLENOID01 (in), SOLENOID02 (in), SOLENOID03 (in), SOLENOID04 (in), SOLENOID05 (in), SOLENOID06 (in), SOLENOID07 (in), SOLENOID08 (in), SOLENOID09 (in), SOLENOID10 (in)

### Nets
12V: *21.1 *21.2 *22.1 *22.2 *23.1 *23.2 *24.1 *24.2 *25.1 *25.2 *26.1 *26.2 *33.1 *33.2 *34.1 *34.2 *35.1 *35.2 *36.1 *36.2 *37.1 *37.2 *38.1 *38.2 *45.1 *45.2 *46.1 *46.2 *47.1 *47.2 *48.1 *48.2 *49.1 *49.2 *50.1 *50.2 *57.1 *57.2 *58.1 *58.2 *59.1 *59.2 *60.1 *60.2 *61.1 *61.2 *62.1 *62.2 *69.1 *69.2 *70.1 *70.2 *71.1 *71.2 *72.1 *72.2 *73.1 *73.2 *74.1 *74.2
GND: *3.1 *3.2 *4.1 *4.2 *7.1 *7.2 *8.1 *8.2 *11.1 *11.2 *12.1 *12.2 *15.1 *15.2 *16.1 *16.2 *19.1 *19.2 *20.1 *20.2 Bit1.1 Bit1.2 Bit1.3 Bit1.4 Bit1.5 Bit1.6 Bit1.7 Bit1.8 Bit1.9 Bit1.10
SOLENOID01: *27.1 *27.2 *29.1 *29.2 Bit1.11(1') ; port SOLENOID01
SOLENOID02: *39.1 *39.2 *41.1 *41.2 Bit1.12(2') ; port SOLENOID02
SOLENOID03: *51.1 *51.2 *53.1 *53.2 Bit1.13(3') ; port SOLENOID03
SOLENOID04: *63.1 *63.2 *65.1 *65.2 Bit1.14(4') ; port SOLENOID04
SOLENOID05: *75.1 *75.2 *77.1 *77.2 Bit1.15(5') ; port SOLENOID05
SOLENOID06: *28.1 *28.2 *30.1 *30.2 Bit1.16(6') ; port SOLENOID06
SOLENOID07: *40.1 *40.2 *42.1 *42.2 Bit1.17(7') ; port SOLENOID07
SOLENOID08: *52.1 *52.2 *54.1 *54.2 Bit1.18(8') ; port SOLENOID08
SOLENOID09: *64.1 *64.2 *66.1 *66.2 Bit1.19(9') ; port SOLENOID09
SOLENOID10: *76.1 *76.2 *78.1 *78.2 Bit1.20(10') ; port SOLENOID10
Net*1_1: *1.1 *1.2 *2.1 *2.2 *5.1 *5.2 *6.1 *6.2 *9.1 *9.2 *10.1 *10.2 *13.1 *13.2 *14.1 *14.2 *17.1 *17.2 *18.1 *18.2 ; port DOOR01, port DOOR02, port DOOR03, port DOOR04, port DOOR05, port DOOR06, port DOOR07, port DOOR08, port DOOR09, port DOOR10
Net*31_1: *31.1 *31.2 ; port RED_LED01
Net*32_1: *32.1 *32.2 ; port RED_LED06
Net*43_1: *43.1 *43.2 ; port RED_LED02
Net*44_1: *44.1 *44.2 ; port RED_LED07
Net*55_1: *55.1 *55.2 ; port RED_LED03
Net*56_1: *56.1 *56.2 ; port RED_LED08
Net*67_1: *67.1 *67.2 ; port RED_LED04
Net*68_1: *68.1 *68.2 ; port RED_LED09
Net*79_1: *79.1 *79.2 ; port RED_LED05
Net*80_1: *80.1 *80.2 ; port RED_LED10

### Notes on the sheet
- (in symbol 6#Bit_Switch_10) ON

### Library data of the parts
*1-*80 = 5#Terminalx1
Bit1 = 6#Bit_Switch_10

## Sheet Power.SchDoc
size A
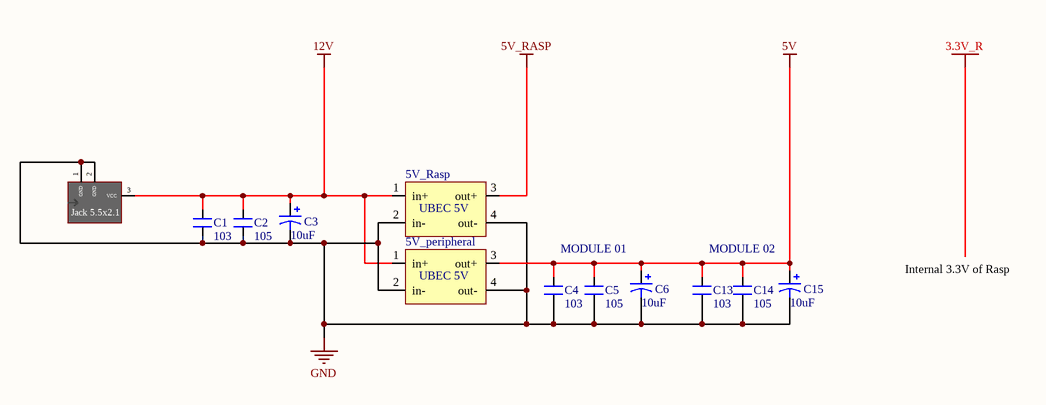
[diagram p5: Power.SchDoc]

### Parts
5V_peripheral  UBEC  [UBEC]  (value not drawn)
5V_Rasp  UBEC  [UBEC]  (value not drawn)
C1  103  [CN1]
C2  105  [CN1]
C3  10uF  [CP2/5]
C4  103  [CN1]
C5  105  [CN1]
C6  10uF  [CP2/5]
C13  103  [CN1]
C14  105  [CN1]
C15  10uF  [CP2/5]
J1  5#DC Jack 2.54mm  [5#DC Jack 2.54mm]  (value not drawn)

### Nets
5V: 5V_peripheral.3(out+) C4.2 C5.2 C6.1 C13.2 C14.2 C15.1
5V_RASP: 5V_Rasp.3(out+)
12V: 5V_peripheral.1(in+) 5V_Rasp.1(in+) C1.2 C2.2 C3.1 J1.3(VCC)
GND: 5V_peripheral.2(in-) 5V_peripheral.4(out-) 5V_Rasp.2(in-) 5V_Rasp.4(out-) C1.1 C2.1 C3.2 C4.1 C5.1 C6.2 C13.1 C14.1 C15.2 J1.1(GND) J1.2(GND)

### Notes on the sheet
- 3.3V_R
- MODULE 01
- MODULE 02
- Internal 3.3V of Rasp
- (in symbol 5#DC Jack 2.54mm) Jack 5.5x2.1
- (in symbol UBEC) UBEC 5V

### Library data of the parts
C1 C2 C4 C5 C13 C14 = CN1: Cap np  1pF - 472pF; Value: 100pF
C3 = Cap Pol3_1: Polarized Capacitor (Surface Mount); Name: C3; LatestRevisionDate: 17-Jul-2002; LatestRevisionNote: Re-released for DXP Platform.; PackageReference: C0805; Publisher: Altium Limited; Value: 10uF
C6 = Cap Pol3_1: Polarized Capacitor (Surface Mount); Name: C6; LatestRevisionDate: 17-Jul-2002; LatestRevisionNote: Re-released for DXP Platform.; PackageReference: C0805; Publisher: Altium Limited; Value: 10uF
C15 = Cap Pol3_1: Polarized Capacitor (Surface Mount); Name: C15; LatestRevisionDate: 17-Jul-2002; LatestRevisionNote: Re-released for DXP Platform.; PackageReference: C0805; Publisher: Altium Limited; Value: 10uF

## Sheet Module02.SchDoc
size A
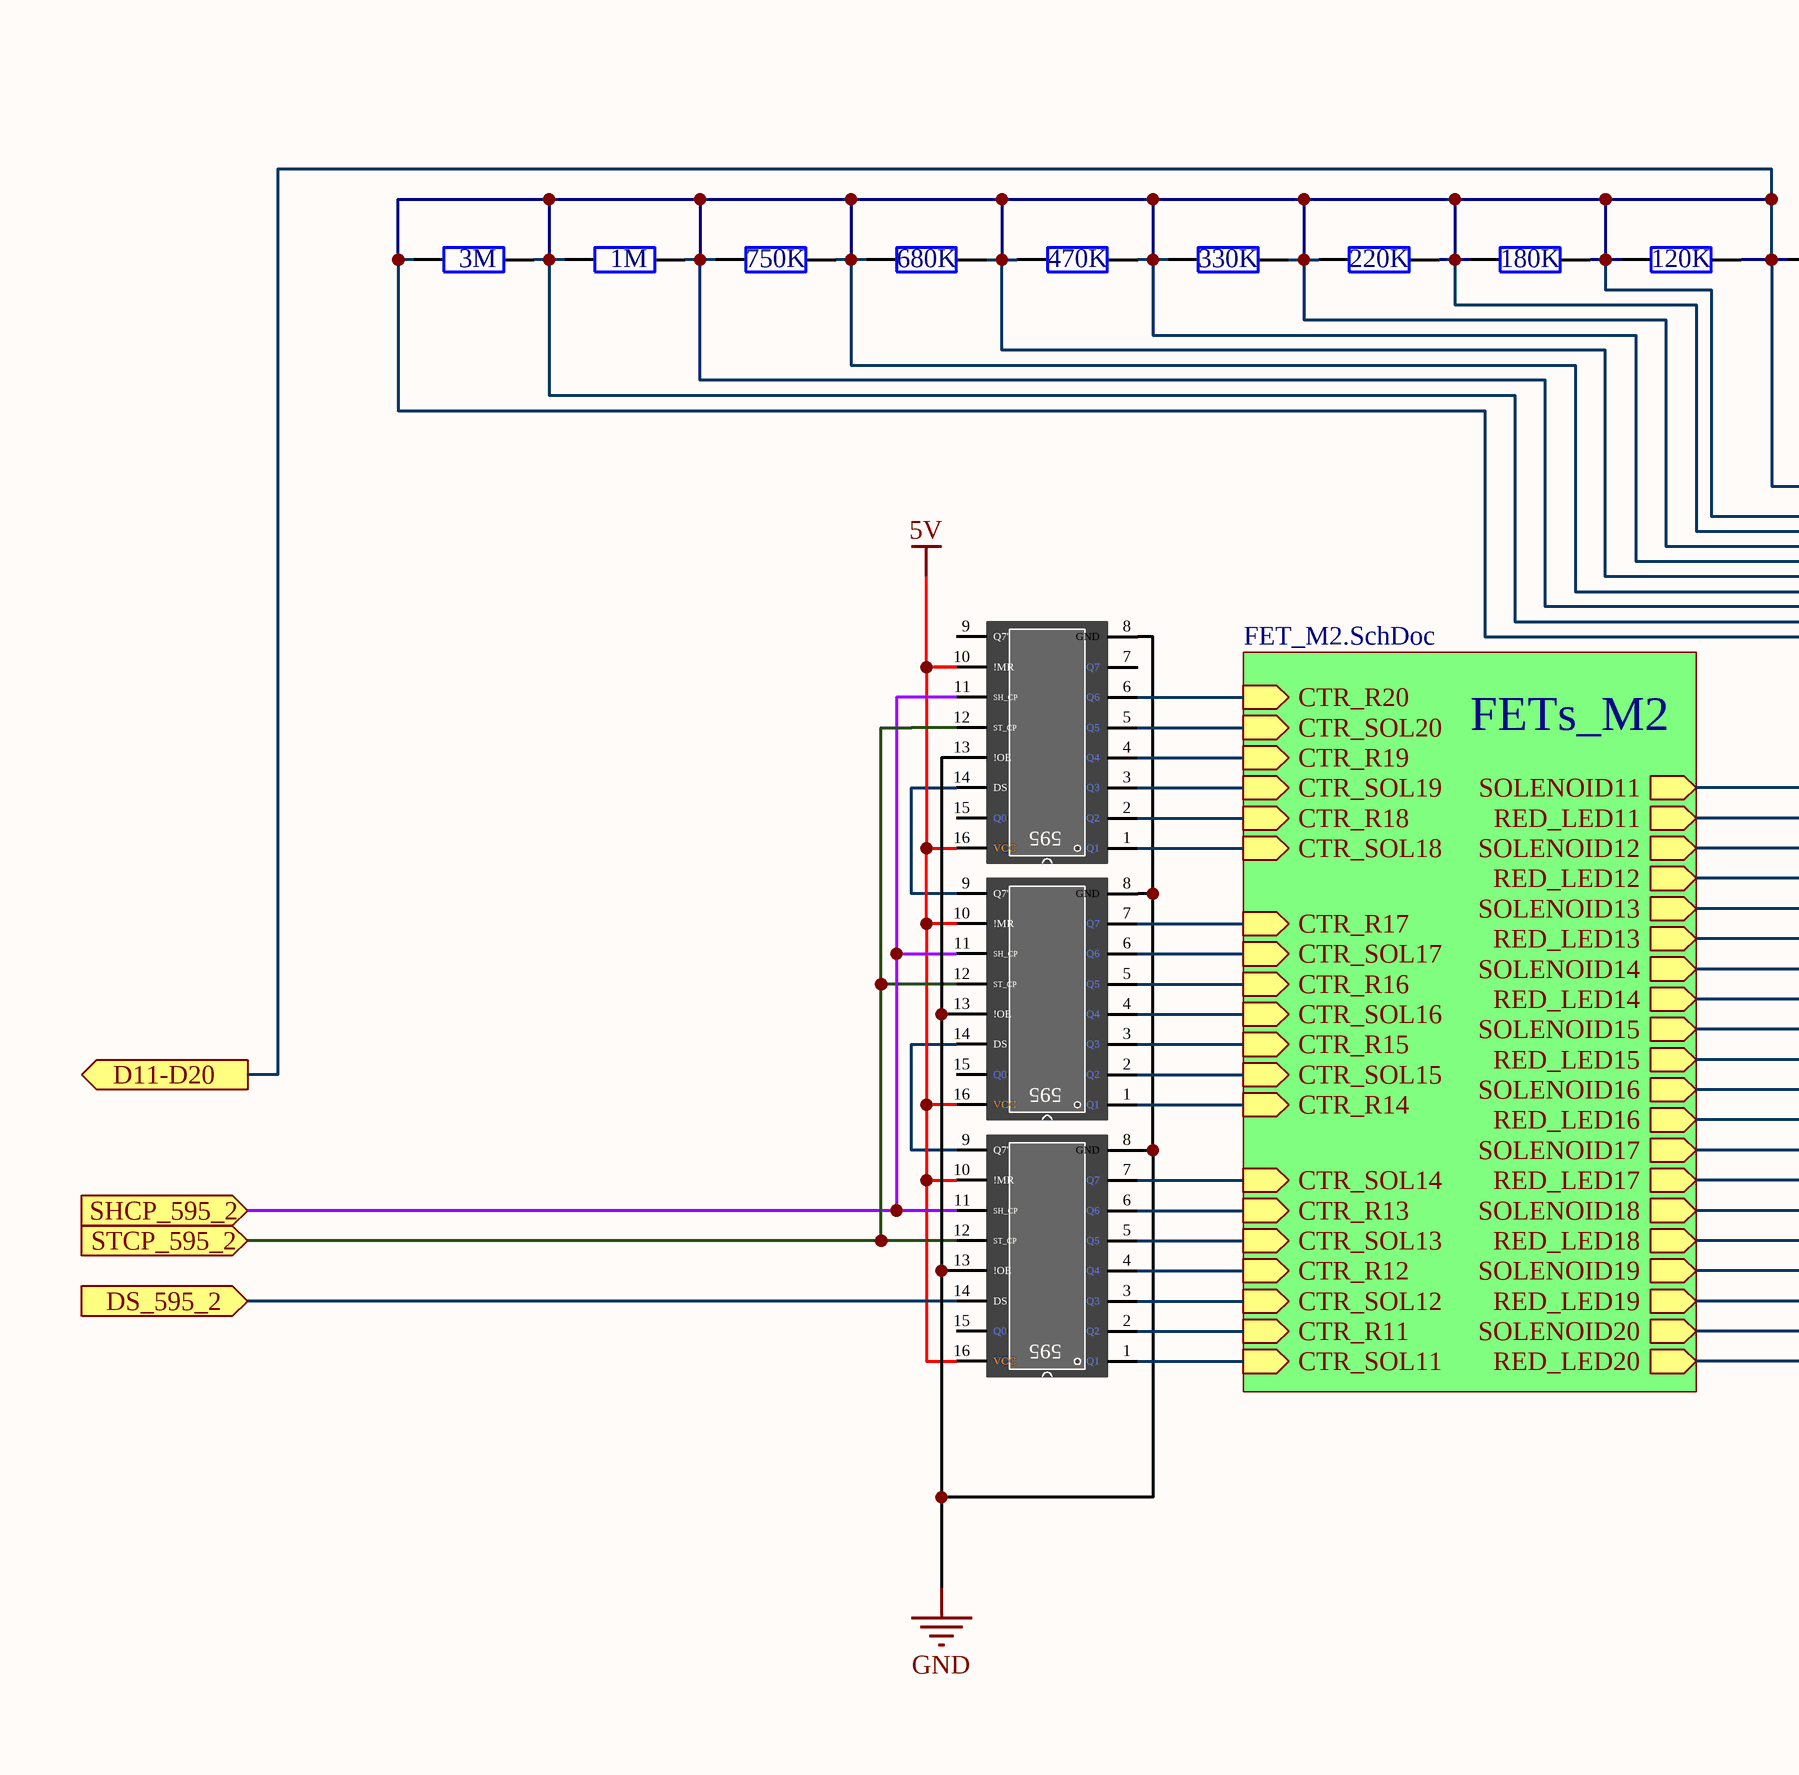
[diagram p6: Module02.SchDoc, left]
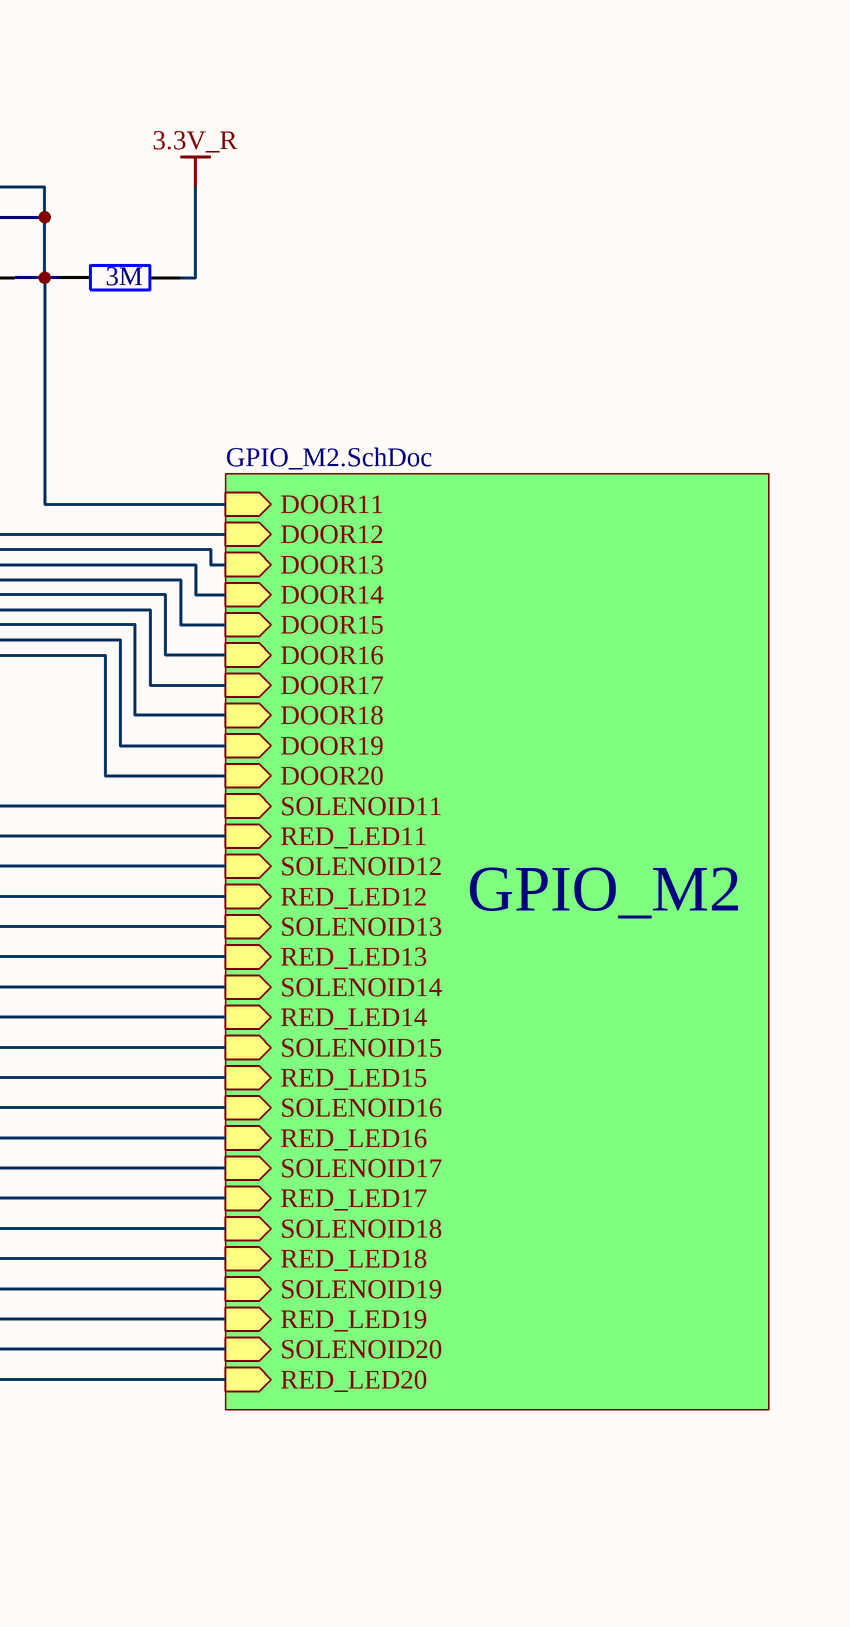
[diagram p7: Module02.SchDoc, right]

### Parts
4  5#HC74595  [5#HC74595]  (value not drawn)
5  5#HC74595  [5#HC74595]  (value not drawn)
6  5#HC74595  [5#HC74595]  (value not drawn)
R11  3M  [AXIAL-0.4]
R12  1M  [AXIAL-0.4]
R58  750K  [AXIAL-0.4]
R59  680K  [AXIAL-0.4]
R60  470K  [AXIAL-0.4]
R61  330K  [AXIAL-0.4]
R62  220K  [AXIAL-0.4]
R63  180K  [AXIAL-0.4]
R64  120K  [AXIAL-0.4]
R65  3M  [AXIAL-0.4]

### Sub-sheets
FETs_M2 = FET_M2.SchDoc: CTR_SOL11 (in), CTR_R11 (in), SOLENOID11 (out), RED_LED11 (out), CTR_SOL14 (in), CTR_R14 (in), SOLENOID14 (out), RED_LED14 (out), CTR_SOL17 (in), CTR_R17 (in), SOLENOID17 (out), RED_LED17 (out), CTR_SOL19 (in), CTR_R19 (in), SOLENOID19 (out), RED_LED19 (out), CTR_SOL12 (in), CTR_R12 (in), SOLENOID12 (out), RED_LED12 (out), CTR_SOL15 (in), CTR_R15 (in), SOLENOID15 (out), RED_LED15 (out), CTR_SOL18 (in), CTR_R18 (in), SOLENOID18 (out), RED_LED18 (out), CTR_SOL20 (in), CTR_R20 (in), SOLENOID20 (out), RED_LED20 (out), CTR_SOL13 (in), CTR_R13 (in), SOLENOID13 (out), RED_LED13 (out), CTR_SOL16 (in), CTR_R16 (in), SOLENOID16 (out), RED_LED16 (out)
GPIO_M2 = GPIO_M2.SchDoc: DOOR11 (in), DOOR12 (in), DOOR13 (in), DOOR14 (in), DOOR15 (in), SOLENOID11 (in), RED_LED11 (in), SOLENOID12 (in), RED_LED12 (in), SOLENOID13 (in), RED_LED13 (in), SOLENOID14 (in), RED_LED14 (in), SOLENOID15 (in), RED_LED15 (in), DOOR16 (in), DOOR17 (in), DOOR18 (in), DOOR19 (in), DOOR20 (in), SOLENOID16 (in), RED_LED16 (in), SOLENOID17 (in), RED_LED17 (in), SOLENOID18 (in), RED_LED18 (in), SOLENOID19 (in), RED_LED19 (in), SOLENOID20 (in), RED_LED20 (in)

### Ports
D11-D20 (out), DS_595_2 (in), SHCP_595_2 (in), STCP_595_2 (in)

### Nets
3.3V_R: R65.1
5V: 4.10(!MR) 4.16(VCC) 5.10(!MR) 5.16(VCC) 6.10(!MR) 6.16(VCC)
GND: 4.8(GND) 4.13(!OE) 5.8(GND) 5.13(!OE) 6.8(GND) 6.13(!OE)
2_N: 6.14(DS) ; port DS_595_2
2_P: 4.11(SH_CP) 5.11(SH_CP) 6.11(SH_CP) ; port SHCP_595_2
SOLENOID11: sheet FETs_M2/SOLENOID11, sheet GPIO_M2/SOLENOID11
SOLENOID12: sheet FETs_M2/SOLENOID12, sheet GPIO_M2/SOLENOID12
SOLENOID13: sheet FETs_M2/SOLENOID13, sheet GPIO_M2/SOLENOID13
SOLENOID14: sheet FETs_M2/SOLENOID14, sheet GPIO_M2/SOLENOID14
SOLENOID15: sheet FETs_M2/SOLENOID15, sheet GPIO_M2/SOLENOID15
SOLENOID16: sheet FETs_M2/SOLENOID16, sheet GPIO_M2/SOLENOID16
SOLENOID17: sheet FETs_M2/SOLENOID17, sheet GPIO_M2/SOLENOID17
SOLENOID18: sheet FETs_M2/SOLENOID18, sheet GPIO_M2/SOLENOID18
SOLENOID19: sheet FETs_M2/SOLENOID19, sheet GPIO_M2/SOLENOID19
SOLENOID20: sheet FETs_M2/SOLENOID20, sheet GPIO_M2/SOLENOID20
Net4_1: 4.1(Q1) ; sheet FETs_M2/CTR_SOL18
Net4_2: 4.2(Q2) ; sheet FETs_M2/CTR_R18
Net4_3: 4.3(Q3) ; sheet FETs_M2/CTR_SOL19
Net4_4: 4.4(Q4) ; sheet FETs_M2/CTR_R19
Net4_5: 4.5(Q5) ; sheet FETs_M2/CTR_SOL20
Net4_6: 4.6(Q6) ; sheet FETs_M2/CTR_R20
Net4_12: 4.12(ST_CP) 5.12(ST_CP) 6.12(ST_CP) ; port STCP_595_2
Net4_14: 4.14(DS) 5.9(Q7')
Net5_1: 5.1(Q1) ; sheet FETs_M2/CTR_R14
Net5_2: 5.2(Q2) ; sheet FETs_M2/CTR_SOL15
Net5_3: 5.3(Q3) ; sheet FETs_M2/CTR_R15
Net5_4: 5.4(Q4) ; sheet FETs_M2/CTR_SOL16
Net5_5: 5.5(Q5) ; sheet FETs_M2/CTR_R16
Net5_6: 5.6(Q6) ; sheet FETs_M2/CTR_SOL17
Net5_7: 5.7(Q7) ; sheet FETs_M2/CTR_R17
Net5_14: 5.14(DS) 6.9(Q7')
Net6_1: 6.1(Q1) ; sheet FETs_M2/CTR_SOL11
Net6_2: 6.2(Q2) ; sheet FETs_M2/CTR_R11
Net6_3: 6.3(Q3) ; sheet FETs_M2/CTR_SOL12
Net6_4: 6.4(Q4) ; sheet FETs_M2/CTR_R12
Net6_5: 6.5(Q5) ; sheet FETs_M2/CTR_SOL13
Net6_6: 6.6(Q6) ; sheet FETs_M2/CTR_R13
Net6_7: 6.7(Q7) ; sheet FETs_M2/CTR_SOL14
Net*81_1: R11.1 R11.2 R12.1 R12.2 R58.1 R58.2 R59.1 R59.2 R60.1 R60.2 R61.1 R61.2 R62.1 R62.2 R63.1 R63.2 R64.1 R64.2 R65.2 ; port D11-D20, sheet GPIO_M2/DOOR11, sheet GPIO_M2/DOOR12, sheet GPIO_M2/DOOR13, sheet GPIO_M2/DOOR14, sheet GPIO_M2/DOOR15, sheet GPIO_M2/DOOR16, sheet GPIO_M2/DOOR17, sheet GPIO_M2/DOOR18, sheet GPIO_M2/DOOR19, sheet GPIO_M2/DOOR20
Net*106_1: sheet FETs_M2/RED_LED11, sheet GPIO_M2/RED_LED11
Net*112_1: sheet FETs_M2/RED_LED12, sheet GPIO_M2/RED_LED12
Net*118_1: sheet FETs_M2/RED_LED13, sheet GPIO_M2/RED_LED13
Net*124_1: sheet FETs_M2/RED_LED14, sheet GPIO_M2/RED_LED14
Net*130_1: sheet FETs_M2/RED_LED15, sheet GPIO_M2/RED_LED15
Net*136_1: sheet FETs_M2/RED_LED16, sheet GPIO_M2/RED_LED16
Net*142_1: sheet FETs_M2/RED_LED17, sheet GPIO_M2/RED_LED17
Net*148_1: sheet FETs_M2/RED_LED18, sheet GPIO_M2/RED_LED18
Net*154_1: sheet FETs_M2/RED_LED19, sheet GPIO_M2/RED_LED19
Net*160_1: sheet FETs_M2/RED_LED20, sheet GPIO_M2/RED_LED20

Not connected (* = marked no-connect by the designer): 4 7(Q7) 9(Q7') 15(Q0); 5 15(Q0); 6 15(Q0)

### Notes on the sheet
- (in symbol 5#HC74595) 595

### Library data of the parts
R11 R12 R58-R65 = Res2: Resistor; Published: 8-Jun-2000; LatestRevisionDate: 17-Jul-2002; LatestRevisionNote: Re-released for DXP Platform.; PackageReference: AXIAL-0.4; Publisher: Altium Limited; PackageDescription: Axial Device, Thru-Hole; 2 Leads; 0.4 in Pin Spacing

## Sheet FET_M2.SchDoc
size A
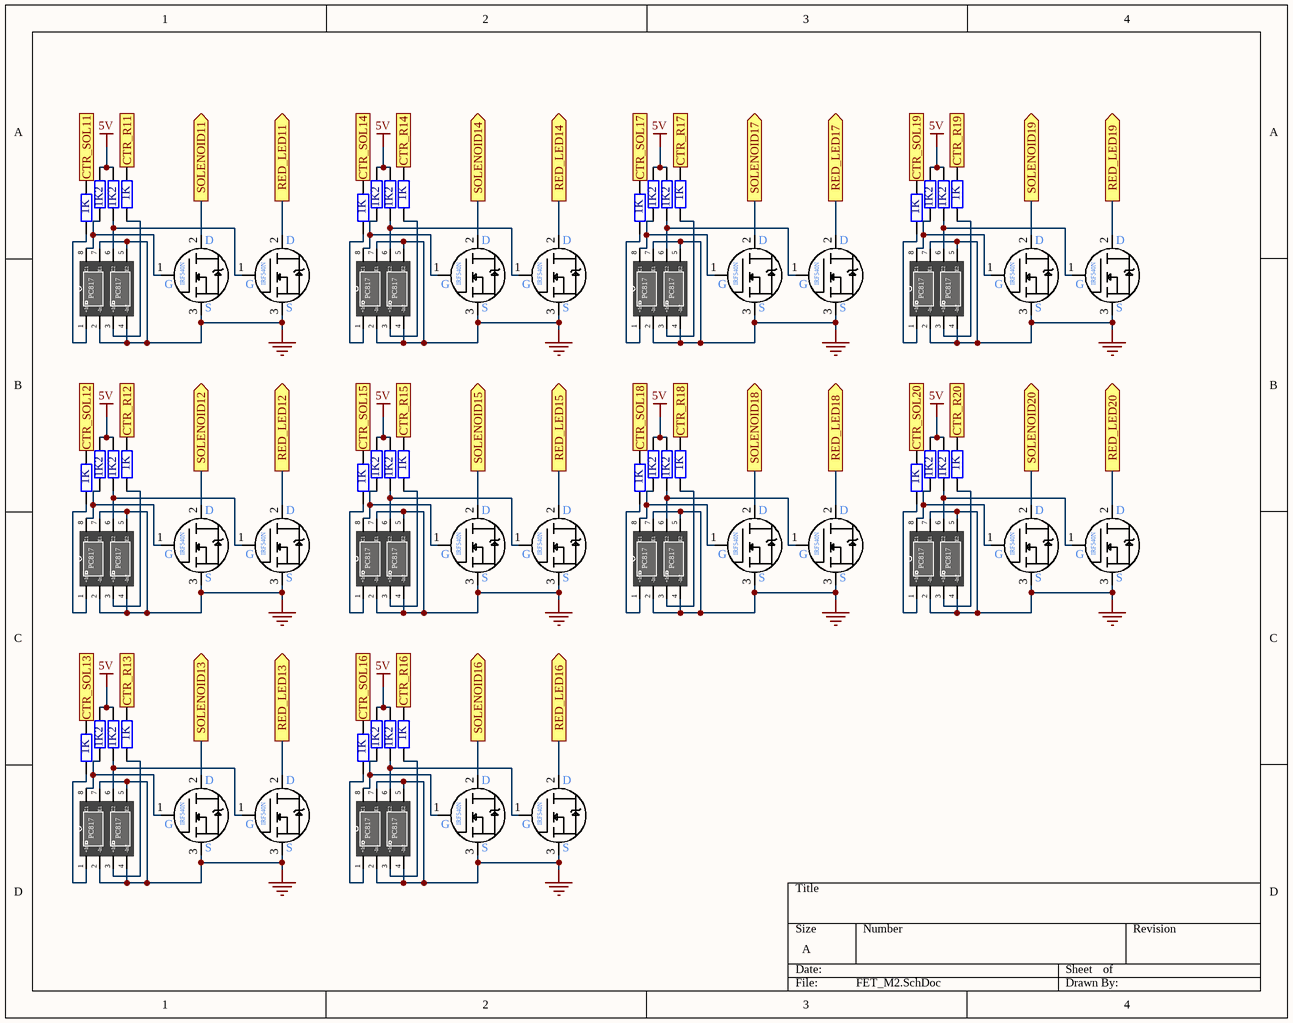
[diagram p8: FET_M2.SchDoc]

### Parts
FET21  5#IRF540N  [5#IRF540N]  (value not drawn)
FET22  5#IRF540N  [5#IRF540N]  (value not drawn)
FET23  5#IRF540N  [5#IRF540N]  (value not drawn)
FET24  5#IRF540N  [5#IRF540N]  (value not drawn)
FET25  5#IRF540N  [5#IRF540N]  (value not drawn)
FET26  5#IRF540N  [5#IRF540N]  (value not drawn)
FET27  5#IRF540N  [5#IRF540N]  (value not drawn)
FET28  5#IRF540N  [5#IRF540N]  (value not drawn)
FET29  5#IRF540N  [5#IRF540N]  (value not drawn)
FET30  5#IRF540N  [5#IRF540N]  (value not drawn)
FET31  5#IRF540N  [5#IRF540N]  (value not drawn)
FET32  5#IRF540N  [5#IRF540N]  (value not drawn)
FET33  5#IRF540N  [5#IRF540N]  (value not drawn)
FET34  5#IRF540N  [5#IRF540N]  (value not drawn)
FET35  5#IRF540N  [5#IRF540N]  (value not drawn)
FET36  5#IRF540N  [5#IRF540N]  (value not drawn)
FET37  5#IRF540N  [5#IRF540N]  (value not drawn)
FET38  5#IRF540N  [5#IRF540N]  (value not drawn)
FET39  5#IRF540N  [5#IRF540N]  (value not drawn)
FET40  5#IRF540N  [5#IRF540N]  (value not drawn)
PC11  5#Dip8_PC817x2  [5#Dip8_PC817x2]  (value not drawn)
PC12  5#Dip8_PC817x2  [5#Dip8_PC817x2]  (value not drawn)
PC13  5#Dip8_PC817x2  [5#Dip8_PC817x2]  (value not drawn)
PC14  5#Dip8_PC817x2  [5#Dip8_PC817x2]  (value not drawn)
PC15  5#Dip8_PC817x2  [5#Dip8_PC817x2]  (value not drawn)
PC16  5#Dip8_PC817x2  [5#Dip8_PC817x2]  (value not drawn)
PC17  5#Dip8_PC817x2  [5#Dip8_PC817x2]  (value not drawn)
PC18  5#Dip8_PC817x2  [5#Dip8_PC817x2]  (value not drawn)
PC19  5#Dip8_PC817x2  [5#Dip8_PC817x2]  (value not drawn)
PC20  5#Dip8_PC817x2  [5#Dip8_PC817x2]  (value not drawn)
R66  1K2  [AXIAL-0.4]
R67  1K2  [AXIAL-0.4]
R68  1K  [AXIAL-0.4]
R69  1K2  [AXIAL-0.4]
R70  1K2  [AXIAL-0.4]
R71  1K  [AXIAL-0.4]
R72  1K2  [AXIAL-0.4]
R73  1K2  [AXIAL-0.4]
R74  1K  [AXIAL-0.4]
R75  1K2  [AXIAL-0.4]
R76  1K2  [AXIAL-0.4]
R77  1K  [AXIAL-0.4]
R78  1K  [AXIAL-0.4]
R79  1K  [AXIAL-0.4]
R80  1K  [AXIAL-0.4]
R81  1K  [AXIAL-0.4]
R82  1K2  [AXIAL-0.4]
R83  1K2  [AXIAL-0.4]
R84  1K  [AXIAL-0.4]
R85  1K2  [AXIAL-0.4]
R86  1K2  [AXIAL-0.4]
R87  1K  [AXIAL-0.4]
R88  1K2  [AXIAL-0.4]
R89  1K2  [AXIAL-0.4]
R90  1K  [AXIAL-0.4]
R91  1K2  [AXIAL-0.4]
R92  1K2  [AXIAL-0.4]
R93  1K  [AXIAL-0.4]
R94  1K  [AXIAL-0.4]
R95  1K  [AXIAL-0.4]
R96  1K  [AXIAL-0.4]
R97  1K  [AXIAL-0.4]
R98  1K2  [AXIAL-0.4]
R99  1K2  [AXIAL-0.4]
R100  1K  [AXIAL-0.4]
R101  1K2  [AXIAL-0.4]
R102  1K2  [AXIAL-0.4]
R103  1K  [AXIAL-0.4]
R104  1K  [AXIAL-0.4]
R105  1K  [AXIAL-0.4]

### Ports
CTR_R11 (in), CTR_R12 (in), CTR_R13 (in), CTR_R14 (in), CTR_R15 (in), CTR_R16 (in), CTR_R17 (in), CTR_R18 (in), CTR_R19 (in), CTR_R20 (in), CTR_SOL11 (in), CTR_SOL12 (in), CTR_SOL13 (in), CTR_SOL14 (in), CTR_SOL15 (in), CTR_SOL16 (in), CTR_SOL17 (in), CTR_SOL18 (in), CTR_SOL19 (in), CTR_SOL20 (in), RED_LED11 (out), RED_LED12 (out), RED_LED13 (out), RED_LED14 (out), RED_LED15 (out), RED_LED16 (out), RED_LED17 (out), RED_LED18 (out), RED_LED19 (out), RED_LED20 (out), SOLENOID11 (out), SOLENOID12 (out), SOLENOID13 (out), SOLENOID14 (out), SOLENOID15 (out), SOLENOID16 (out), SOLENOID17 (out), SOLENOID18 (out), SOLENOID19 (out), SOLENOID20 (out)

### Nets
5V: R66.2 R67.2 R69.2 R70.2 R72.2 R73.2 R75.2 R76.2 R82.2 R83.2 R85.2 R86.2 R88.2 R89.2 R91.2 R92.2 R98.2 R99.2 R101.2 R102.2
GND: FET21.3(S) FET22.3(S) FET23.3(S) FET24.3(S) FET25.3(S) FET26.3(S) FET27.3(S) FET28.3(S) FET29.3(S) FET30.3(S) FET31.3(S) FET32.3(S) FET33.3(S) FET34.3(S) FET35.3(S) FET36.3(S) FET37.3(S) FET38.3(S) FET39.3(S) FET40.3(S) PC11.2(-In1) PC11.4(-In2) PC11.5(E2) PC11.7(E1) PC12.2(-In1) PC12.4(-In2) PC12.5(E2) PC12.7(E1) PC13.2(-In1) PC13.4(-In2) PC13.5(E2) PC13.7(E1) PC14.2(-In1) PC14.4(-In2) PC14.5(E2) PC14.7(E1) PC15.2(-In1) PC15.4(-In2) PC15.5(E2) PC15.7(E1) PC16.2(-In1) PC16.4(-In2) PC16.5(E2) PC16.7(E1) PC17.2(-In1) PC17.4(-In2) PC17.5(E2) PC17.7(E1) PC18.2(-In1) PC18.4(-In2) PC18.5(E2) PC18.7(E1) PC19.2(-In1) PC19.4(-In2) PC19.5(E2) PC19.7(E1) PC20.2(-In1) PC20.4(-In2) PC20.5(E2) PC20.7(E1)
SOLENOID11: FET21.2(D) ; port SOLENOID11
SOLENOID12: FET29.2(D) ; port SOLENOID12
SOLENOID13: FET37.2(D) ; port SOLENOID13
SOLENOID14: FET23.2(D) ; port SOLENOID14
SOLENOID15: FET31.2(D) ; port SOLENOID15
SOLENOID16: FET39.2(D) ; port SOLENOID16
SOLENOID17: FET25.2(D) ; port SOLENOID17
SOLENOID18: FET33.2(D) ; port SOLENOID18
SOLENOID19: FET27.2(D) ; port SOLENOID19
SOLENOID20: FET35.2(D) ; port SOLENOID20
Net4_1: R96.1 ; port CTR_SOL18
Net4_2: R90.1 ; port CTR_R18
Net4_3: R81.1 ; port CTR_SOL19
Net4_4: R77.1 ; port CTR_R19
Net4_5: R97.1 ; port CTR_SOL20
Net4_6: R93.1 ; port CTR_R20
Net5_1: R71.1 ; port CTR_R14
Net5_2: R95.1 ; port CTR_SOL15
Net5_3: R87.1 ; port CTR_R15
Net5_4: R105.1 ; port CTR_SOL16
Net5_5: R103.1 ; port CTR_R16
Net5_6: R80.1 ; port CTR_SOL17
Net5_7: R74.1 ; port CTR_R17
Net6_1: R78.1 ; port CTR_SOL11
Net6_2: R68.1 ; port CTR_R11
Net6_3: R94.1 ; port CTR_SOL12
Net6_4: R84.1 ; port CTR_R12
Net6_5: R104.1 ; port CTR_SOL13
Net6_6: R100.1 ; port CTR_R13
Net6_7: R79.1 ; port CTR_SOL14
Net*106_1: FET22.2(D) ; port RED_LED11
Net*112_1: FET30.2(D) ; port RED_LED12
Net*118_1: FET38.2(D) ; port RED_LED13
Net*124_1: FET24.2(D) ; port RED_LED14
Net*130_1: FET32.2(D) ; port RED_LED15
Net*136_1: FET40.2(D) ; port RED_LED16
Net*142_1: FET26.2(D) ; port RED_LED17
Net*148_1: FET34.2(D) ; port RED_LED18
Net*154_1: FET28.2(D) ; port RED_LED19
Net*160_1: FET36.2(D) ; port RED_LED20
NetFET21_1: FET21.1(G) PC11.8(C1) R66.1
NetFET22_1: FET22.1(G) PC11.6(C2) R67.1
NetFET23_1: FET23.1(G) PC12.8(C1) R69.1
NetFET24_1: FET24.1(G) PC12.6(C2) R70.1
NetFET25_1: FET25.1(G) PC13.8(C1) R72.1
NetFET26_1: FET26.1(G) PC13.6(C2) R73.1
NetFET27_1: FET27.1(G) PC14.8(C1) R75.1
NetFET28_1: FET28.1(G) PC14.6(C2) R76.1
NetFET29_1: FET29.1(G) PC15.8(C1) R82.1
NetFET30_1: FET30.1(G) PC15.6(C2) R83.1
NetFET31_1: FET31.1(G) PC16.8(C1) R85.1
NetFET32_1: FET32.1(G) PC16.6(C2) R86.1
NetFET33_1: FET33.1(G) PC17.8(C1) R88.1
NetFET34_1: FET34.1(G) PC17.6(C2) R89.1
NetFET35_1: FET35.1(G) PC18.8(C1) R91.1
NetFET36_1: FET36.1(G) PC18.6(C2) R92.1
NetFET37_1: FET37.1(G) PC19.8(C1) R98.1
NetFET38_1: FET38.1(G) PC19.6(C2) R99.1
NetFET39_1: FET39.1(G) PC20.8(C1) R101.1
NetFET40_1: FET40.1(G) PC20.6(C2) R102.1
NetPC11_1: PC11.1(+In1) R78.2
NetPC11_3: PC11.3(+In2) R68.2
NetPC12_1: PC12.1(+In1) R79.2
NetPC12_3: PC12.3(+In2) R71.2
NetPC13_1: PC13.1(+In1) R80.2
NetPC13_3: PC13.3(+In2) R74.2
NetPC14_1: PC14.1(+In1) R81.2
NetPC14_3: PC14.3(+In2) R77.2
NetPC15_1: PC15.1(+In1) R94.2
NetPC15_3: PC15.3(+In2) R84.2
NetPC16_1: PC16.1(+In1) R95.2
NetPC16_3: PC16.3(+In2) R87.2
NetPC17_1: PC17.1(+In1) R96.2
NetPC17_3: PC17.3(+In2) R90.2
NetPC18_1: PC18.1(+In1) R97.2
NetPC18_3: PC18.3(+In2) R93.2
NetPC19_1: PC19.1(+In1) R104.2
NetPC19_3: PC19.3(+In2) R100.2
NetPC20_1: PC20.1(+In1) R105.2
NetPC20_3: PC20.3(+In2) R103.2

### Notes on the sheet
- (in symbol 5#Dip8_PC817x2) PC817
- (in symbol 5#IRF540N) IRF540N

### Library data of the parts
R66-R105 = Res2: Resistor; Published: 8-Jun-2000; LatestRevisionDate: 17-Jul-2002; LatestRevisionNote: Re-released for DXP Platform.; PackageReference: AXIAL-0.4; Publisher: Altium Limited; PackageDescription: Axial Device, Thru-Hole; 2 Leads; 0.4 in Pin Spacing

## Sheet GPIO_M2.SchDoc
size A4
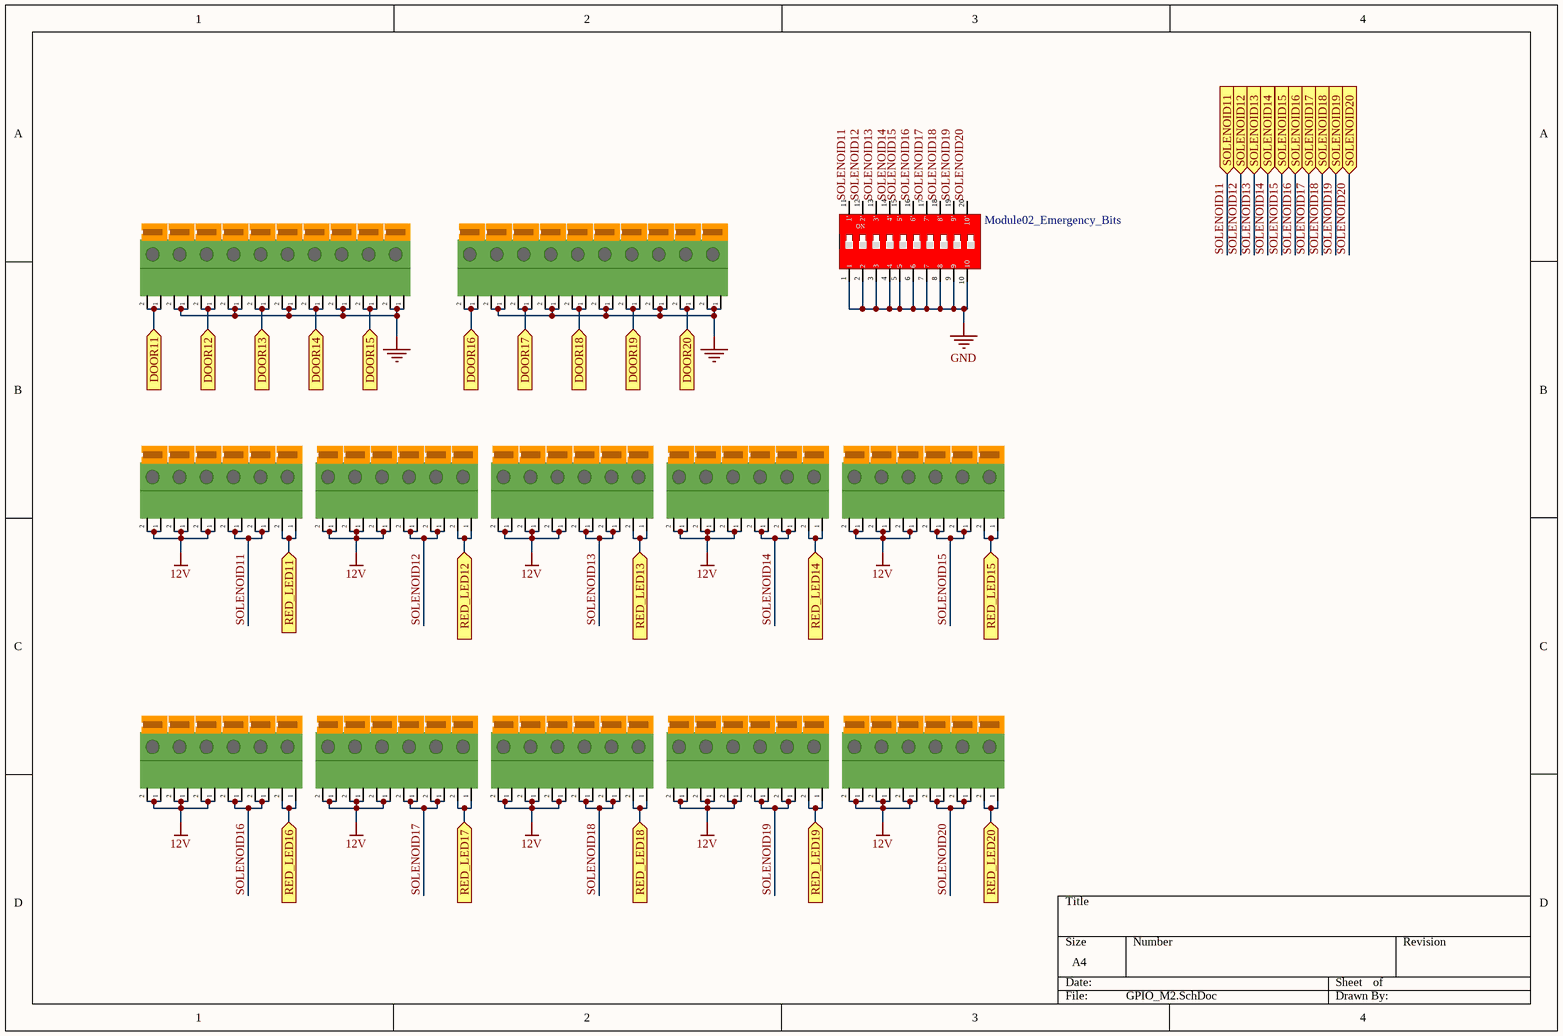
[diagram p9: GPIO_M2.SchDoc]

### Parts
*81  D11  [5#Terminalx1]  (value not drawn)
*82  GND  [5#Terminalx1]  (value not drawn)
*83  D12  [5#Terminalx1]  (value not drawn)
*84  GND  [5#Terminalx1]  (value not drawn)
*85  D13  [5#Terminalx1]  (value not drawn)
*86  GND  [5#Terminalx1]  (value not drawn)
*87  D14  [5#Terminalx1]  (value not drawn)
*88  GND  [5#Terminalx1]  (value not drawn)
*89  D15  [5#Terminalx1]  (value not drawn)
*90  GND  [5#Terminalx1]  (value not drawn)
*91  D16  [5#Terminalx1]  (value not drawn)
*92  GND  [5#Terminalx1]  (value not drawn)
*93  D17  [5#Terminalx1]  (value not drawn)
*94  GND  [5#Terminalx1]  (value not drawn)
*95  D18  [5#Terminalx1]  (value not drawn)
*96  GND  [5#Terminalx1]  (value not drawn)
*97  D19  [5#Terminalx1]  (value not drawn)
*98  GND  [5#Terminalx1]  (value not drawn)
*99  D20  [5#Terminalx1]  (value not drawn)
*100  GND  [5#Terminalx1]  (value not drawn)
*101  12V  [5#Terminalx1]  (value not drawn)
*102  12V  [5#Terminalx1]  (value not drawn)
*103  12V  [5#Terminalx1]  (value not drawn)
*104  S11  [5#Terminalx1]  (value not drawn)
*105  G11  [5#Terminalx1]  (value not drawn)
*106  R11  [5#Terminalx1]  (value not drawn)
*107  12V  [5#Terminalx1]  (value not drawn)
*108  12V  [5#Terminalx1]  (value not drawn)
*109  12V  [5#Terminalx1]  (value not drawn)
*110  S12  [5#Terminalx1]  (value not drawn)
*111  G12  [5#Terminalx1]  (value not drawn)
*112  R12  [5#Terminalx1]  (value not drawn)
*113  12V  [5#Terminalx1]  (value not drawn)
*114  12V  [5#Terminalx1]  (value not drawn)
*115  12V  [5#Terminalx1]  (value not drawn)
*116  S13  [5#Terminalx1]  (value not drawn)
*117  G13  [5#Terminalx1]  (value not drawn)
*118  R13  [5#Terminalx1]  (value not drawn)
*119  12V  [5#Terminalx1]  (value not drawn)
*120  12V  [5#Terminalx1]  (value not drawn)
*121  12V  [5#Terminalx1]  (value not drawn)
*122  S14  [5#Terminalx1]  (value not drawn)
*123  G14  [5#Terminalx1]  (value not drawn)
*124  R14  [5#Terminalx1]  (value not drawn)
*125  12V  [5#Terminalx1]  (value not drawn)
*126  12V  [5#Terminalx1]  (value not drawn)
*127  12V  [5#Terminalx1]  (value not drawn)
*128  S15  [5#Terminalx1]  (value not drawn)
*129  G15  [5#Terminalx1]  (value not drawn)
*130  R15  [5#Terminalx1]  (value not drawn)
*131  12V  [5#Terminalx1]  (value not drawn)
*132  12V  [5#Terminalx1]  (value not drawn)
*133  12V  [5#Terminalx1]  (value not drawn)
*134  S16  [5#Terminalx1]  (value not drawn)
*135  G16  [5#Terminalx1]  (value not drawn)
*136  R16  [5#Terminalx1]  (value not drawn)
*137  12V  [5#Terminalx1]  (value not drawn)
*138  12V  [5#Terminalx1]  (value not drawn)
*139  12V  [5#Terminalx1]  (value not drawn)
*140  S17  [5#Terminalx1]  (value not drawn)
*141  G17  [5#Terminalx1]  (value not drawn)
*142  R17  [5#Terminalx1]  (value not drawn)
*143  12V  [5#Terminalx1]  (value not drawn)
*144  12V  [5#Terminalx1]  (value not drawn)
*145  12V  [5#Terminalx1]  (value not drawn)
*146  S18  [5#Terminalx1]  (value not drawn)
*147  G18  [5#Terminalx1]  (value not drawn)
*148  R18  [5#Terminalx1]  (value not drawn)
*149  12V  [5#Terminalx1]  (value not drawn)
*150  12V  [5#Terminalx1]  (value not drawn)
*151  12V  [5#Terminalx1]  (value not drawn)
*152  S19  [5#Terminalx1]  (value not drawn)
*153  G19  [5#Terminalx1]  (value not drawn)
*154  R19  [5#Terminalx1]  (value not drawn)
*155  12V  [5#Terminalx1]  (value not drawn)
*156  12V  [5#Terminalx1]  (value not drawn)
*157  12V  [5#Terminalx1]  (value not drawn)
*158  S20  [5#Terminalx1]  (value not drawn)
*159  G20  [5#Terminalx1]  (value not drawn)
*160  R20  [5#Terminalx1]  (value not drawn)
Bit2  Module02_Emergency_Bits  [6#Bit_Switch_10]

### Ports
DOOR11 (in), DOOR12 (in), DOOR13 (in), DOOR14 (in), DOOR15 (in), DOOR16 (in), DOOR17 (in), DOOR18 (in), DOOR19 (in), DOOR20 (in), RED_LED11 (in), RED_LED12 (in), RED_LED13 (in), RED_LED14 (in), RED_LED15 (in), RED_LED16 (in), RED_LED17 (in), RED_LED18 (in), RED_LED19 (in), RED_LED20 (in), SOLENOID11 (in), SOLENOID12 (in), SOLENOID13 (in), SOLENOID14 (in), SOLENOID15 (in), SOLENOID16 (in), SOLENOID17 (in), SOLENOID18 (in), SOLENOID19 (in), SOLENOID20 (in)

### Nets
12V: *101.1 *101.2 *102.1 *102.2 *103.1 *103.2 *107.1 *107.2 *108.1 *108.2 *109.1 *109.2 *113.1 *113.2 *114.1 *114.2 *115.1 *115.2 *119.1 *119.2 *120.1 *120.2 *121.1 *121.2 *125.1 *125.2 *126.1 *126.2 *127.1 *127.2 *131.1 *131.2 *132.1 *132.2 *133.1 *133.2 *137.1 *137.2 *138.1 *138.2 *139.1 *139.2 *143.1 *143.2 *144.1 *144.2 *145.1 *145.2 *149.1 *149.2 *150.1 *150.2 *151.1 *151.2 *155.1 *155.2 *156.1 *156.2 *157.1 *157.2
GND: *82.1 *82.2 *84.1 *84.2 *86.1 *86.2 *88.1 *88.2 *90.1 *90.2 *92.1 *92.2 *94.1 *94.2 *96.1 *96.2 *98.1 *98.2 *100.1 *100.2 Bit2.1 Bit2.2 Bit2.3 Bit2.4 Bit2.5 Bit2.6 Bit2.7 Bit2.8 Bit2.9 Bit2.10
SOLENOID11: *104.1 *104.2 *105.1 *105.2 Bit2.11(1') ; port SOLENOID11
SOLENOID12: *110.1 *110.2 *111.1 *111.2 Bit2.12(2') ; port SOLENOID12
SOLENOID13: *116.1 *116.2 *117.1 *117.2 Bit2.13(3') ; port SOLENOID13
SOLENOID14: *122.1 *122.2 *123.1 *123.2 Bit2.14(4') ; port SOLENOID14
SOLENOID15: *128.1 *128.2 *129.1 *129.2 Bit2.15(5') ; port SOLENOID15
SOLENOID16: *134.1 *134.2 *135.1 *135.2 Bit2.16(6') ; port SOLENOID16
SOLENOID17: *140.1 *140.2 *141.1 *141.2 Bit2.17(7') ; port SOLENOID17
SOLENOID18: *146.1 *146.2 *147.1 *147.2 Bit2.18(8') ; port SOLENOID18
SOLENOID19: *152.1 *152.2 *153.1 *153.2 Bit2.19(9') ; port SOLENOID19
SOLENOID20: *158.1 *158.2 *159.1 *159.2 Bit2.20(10') ; port SOLENOID20
Net*81_1: *81.1 *81.2 *83.1 *83.2 *85.1 *85.2 *87.1 *87.2 *89.1 *89.2 *91.1 *91.2 *93.1 *93.2 *95.1 *95.2 *97.1 *97.2 *99.1 *99.2 ; port DOOR11, port DOOR12, port DOOR13, port DOOR14, port DOOR15, port DOOR16, port DOOR17, port DOOR18, port DOOR19, port DOOR20
Net*106_1: *106.1 *106.2 ; port RED_LED11
Net*112_1: *112.1 *112.2 ; port RED_LED12
Net*118_1: *118.1 *118.2 ; port RED_LED13
Net*124_1: *124.1 *124.2 ; port RED_LED14
Net*130_1: *130.1 *130.2 ; port RED_LED15
Net*136_1: *136.1 *136.2 ; port RED_LED16
Net*142_1: *142.1 *142.2 ; port RED_LED17
Net*148_1: *148.1 *148.2 ; port RED_LED18
Net*154_1: *154.1 *154.2 ; port RED_LED19
Net*160_1: *160.1 *160.2 ; port RED_LED20

### Notes on the sheet
- (in symbol 6#Bit_Switch_10) ON

### Library data of the parts
*81-*160 = 5#Terminalx1
Bit2 = 6#Bit_Switch_10

## Sheet MCU.SchDoc
size A4
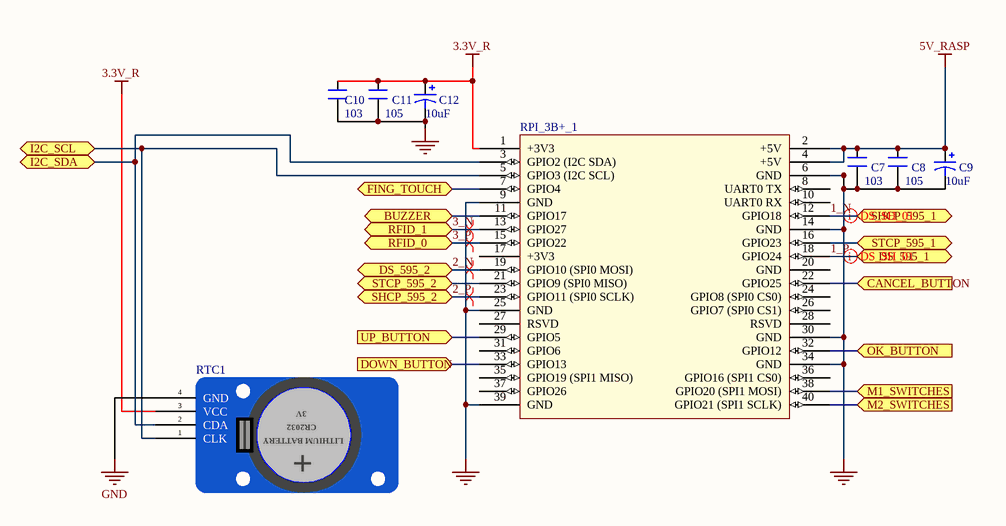
[diagram p10: MCU.SchDoc]

### Parts
C7  103  [CN1]
C8  105  [CN1]
C9  10uF  [CP2/5]
C10  103  [CN1]
C11  105  [CN1]
C12  10uF  [CP2/5]
RPI_3B+_1  RPI GPIO Connector  [RPI-holes]  (value not drawn)
RTC1  6#RTC_DS3231_4Pin  [6#RTC_DS3231_4Pin]  (value not drawn)

### Ports
BUZZER (bidir), CANCEL_BUTTON (in), DOWN_BUTTON (in), DS_595_1 (bidir), DS_595_2 (bidir), FING_TOUCH (bidir), I2C_SCL (bidir), I2C_SDA (bidir), M1_SWITCHES (in), M2_SWITCHES (in), OK_BUTTON (in), RFID_0 (bidir), RFID_1 (bidir), SHCP_595_1 (bidir), SHCP_595_2 (bidir), STCP_595_1 (bidir), STCP_595_2 (bidir), UP_BUTTON (in)

### Nets
3.3V_R: C10.2 C11.2 C12.1 RPI_3B+_1.1(+3V3) RTC1.3(VCC)
5V_RASP: C7.2 C8.2 C9.1 RPI_3B+_1.2(+5V) RPI_3B+_1.4(+5V)
GND: C7.1 C8.1 C9.2 C10.1 C11.1 C12.2 RPI_3B+_1.6(GND) RPI_3B+_1.9(GND) RPI_3B+_1.14(GND) RPI_3B+_1.25(GND) RPI_3B+_1.30(GND) RPI_3B+_1.34(GND) RPI_3B+_1.39(GND) RTC1.4(GND)
1_N: RPI_3B+_1.12(GPIO18) ; port SHCP_595_1
1_P: RPI_3B+_1.18(GPIO24) ; port DS_595_1
2_N: RPI_3B+_1.19(GPIO10_(SPI0_MOSI)) ; port DS_595_2
2_P: RPI_3B+_1.23(GPIO11_(SPI0_SCLK)) ; port SHCP_595_2
3_N: RPI_3B+_1.13(GPIO27) ; port RFID_1
3_P: RPI_3B+_1.15(GPIO22) ; port RFID_0
Net1_12: RPI_3B+_1.16(GPIO23) ; port STCP_595_1
Net4_12: RPI_3B+_1.21(GPIO9_(SPI0_MISO)) ; port STCP_595_2
NetConverter_1_11: RPI_3B+_1.11(GPIO17) ; port BUZZER
NetInterface_Connector_9: RPI_3B+_1.3(GPIO2_(I2C_SDA)) RTC1.2(CDA) ; port I2C_SDA
NetInterface_Connector_19: RPI_3B+_1.5(GPIO3_(I2C_SCL)) RTC1.1(CLK) ; port I2C_SCL
NetInterface_Connector_20: RPI_3B+_1.7(GPIO4) ; port FING_TOUCH
NetRPI_3B+_1_22: RPI_3B+_1.22(GPIO25) ; port CANCEL_BUTTON
NetRPI_3B+_1_29: RPI_3B+_1.29(GPIO5) ; port UP_BUTTON
NetRPI_3B+_1_32: RPI_3B+_1.32(GPIO12) ; port OK_BUTTON
NetRPI_3B+_1_33: RPI_3B+_1.33(GPIO13) ; port DOWN_BUTTON
NetRPI_3B+_1_38: RPI_3B+_1.38(GPIO20_(SPI1_MOSI)) ; port M1_SWITCHES
NetRPI_3B+_1_40: RPI_3B+_1.40(GPIO21_(SPI1_SCLK)) ; port M2_SWITCHES

Not connected (* = marked no-connect by the designer): RPI_3B+_1 8(UART0_TX) 10(UART0_RX) 17(+3V3) 20(GND) 24(GPIO8_(SPI0_CS0)) 26(GPIO7_(SPI0_CS1)) 27(RSVD) 28(RSVD) 31(GPIO6) 35(GPIO19_(SPI1_MISO)) 36(GPIO16_(SPI1_CS0)) 37(GPIO26)

### Layout directives
differential pair: 1_N, 1_P, 2_N, 2_P, 3_N, 3_P

### Notes on the sheet
- (in symbol 6#RTC_DS3231_4Pin) 3V; CR2032; +; LITHIUM BATTERY

### Library data of the parts
C7 C8 C10 C11 = CN1: Cap np  1pF - 472pF; Value: 100pF
C9 C12 = Cap Pol3_1: Polarized Capacitor (Surface Mount); Name: C9; LatestRevisionDate: 17-Jul-2002; LatestRevisionNote: Re-released for DXP Platform.; PackageReference: C0805; Publisher: Altium Limited; Value: 10uF
RPI_3B+_1 = rpi connector_2holes: GPIO Header for Raspberry Pi A+/B+/Pi 2/Pi 3 - 2x20; Manufacturer: SparkFun Electronics; Manufacturer Part Number: PRT-14017; Nils Minor: author; nilsminor@web.de: mail; RoHS: RoHS Compliant; Category: Development Boards, Kits, Programmers; Stock 1: 150; Pricing 1: 1=1.84 (EUR); Part Status: Active; Accessory Type: Connector; For Use With/Related Products: Raspberry Pi; ComponentLink1URL: https://cdn.sparkfun.com/datasheets/Dev/RaspberryPi/12313.pdf; ComponentLink1Description: https://cdn.sparkfun.com/datasheets/Dev/RaspberryPi/12313.pdf; Supplier 1: Digi-Key; Supplier Part Number 1: 1568-1462-ND

## Sheet Interface.SchDoc
size A
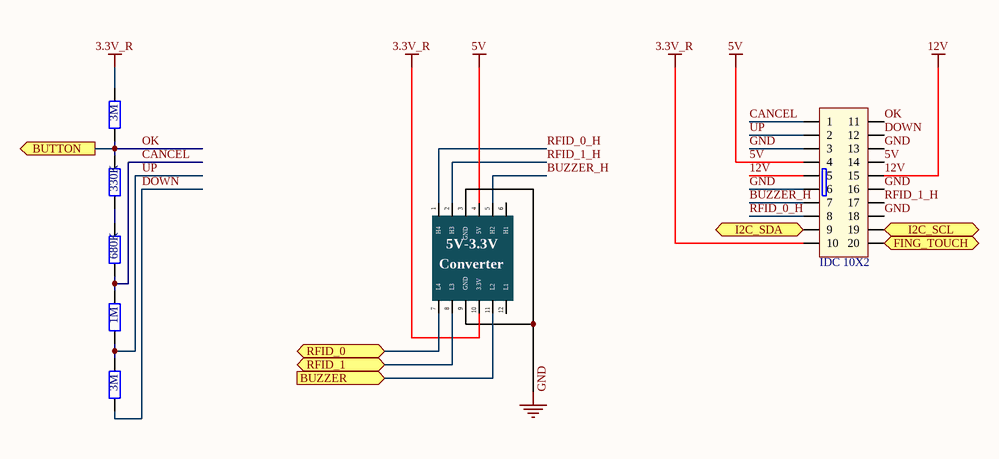
[diagram p11: Interface.SchDoc]

### Parts
Converter_1  Bidirection converter  [5V_3V3_Converter]  (value not drawn)
Interface_Connector  IDC 10X2  [IDC20]
R13  3M  [AXIAL-0.4]
R14  330K  [AXIAL-0.4]
R15  680K  [AXIAL-0.4]
R16  1M  [AXIAL-0.4]
R17  3M  [AXIAL-0.4]

### Ports
BUTTON (out), BUZZER (in), FING_TOUCH (bidir), I2C_SCL (bidir), I2C_SDA (bidir), RFID_0 (bidir), RFID_1 (bidir)

### Nets
3.3V_R: Converter_1.10(3.3V) Interface_Connector.10 R13.1
5V: Converter_1.4(5V) Interface_Connector.4 Interface_Connector.14
12V: Interface_Connector.5 Interface_Connector.15
GND: Converter_1.3(GND) Converter_1.9(GND) Interface_Connector.3 Interface_Connector.6 Interface_Connector.13 Interface_Connector.16 Interface_Connector.18
3_N: Converter_1.8(L3) ; port RFID_1
3_P: Converter_1.7(L4) ; port RFID_0
BUZZER_H: Converter_1.5(H2) Interface_Connector.7
CANCEL: Interface_Connector.1 R15.2 R16.1
DOWN: Interface_Connector.12 R17.2
OK: Interface_Connector.11 R13.2 R14.1 ; port BUTTON
RFID_0_H: Converter_1.1(H4) Interface_Connector.8
RFID_1_H: Converter_1.2(H3) Interface_Connector.17
UP: Interface_Connector.2 R16.2 R17.1
NetConverter_1_11: Converter_1.11(L2) ; port BUZZER
NetInterface_Connector_9: Interface_Connector.9 ; port I2C_SDA
NetInterface_Connector_19: Interface_Connector.19 ; port I2C_SCL
NetInterface_Connector_20: Interface_Connector.20 ; port FING_TOUCH
NetR14_2: R14.2 R15.1

Not connected (* = marked no-connect by the designer): Converter_1 6(H1) 12(L1)

### Notes on the sheet
- (in symbol 5V-3.3V-converter) 5V-3.3V; Converter

### Library data of the parts
Converter_1 = 5V-3.3V-converter
Interface_Connector = IDC 10X2: Value: Header 5x2
R13-R17 = Res2: Resistor; Published: 8-Jun-2000; LatestRevisionDate: 17-Jul-2002; LatestRevisionNote: Re-released for DXP Platform.; PackageReference: AXIAL-0.4; Publisher: Altium Limited; PackageDescription: Axial Device, Thru-Hole; 2 Leads; 0.4 in Pin Spacing

## Nets that join several sheets
3.3V_R: Module01 (R10.1), Module02 (R65.1), MCU (5 pins), Interface (Converter_1.10 Interface_Connector.10 R13.1)
5V: Module01 (6 pins), FET_M1 (20 pins), Power (7 pins), Module02 (6 pins), FET_M2 (20 pins), Interface (Converter_1.4 Interface_Connector.4 Interface_Connector.14)
5V_RASP: Power (5V_Rasp.3), MCU (5 pins)
12V: GPIO_M1 (60 pins), Power (6 pins), GPIO_M2 (60 pins), Interface (Interface_Connector.5 Interface_Connector.15)
GND: Module01 (6 pins), FET_M1 (60 pins), GPIO_M1 (30 pins), Power (15 pins), Module02 (6 pins), FET_M2 (60 pins), GPIO_M2 (30 pins), MCU (14 pins), Interface (7 pins)
1_N: Module01 (1.11 2.11 3.11), MCU (RPI_3B+_1.12)
1_P: Module01 (1.14), MCU (RPI_3B+_1.18)
2_N: Module02 (6.14), MCU (RPI_3B+_1.19)
2_P: Module02 (4.11 5.11 6.11), MCU (RPI_3B+_1.23)
3_N: MCU (RPI_3B+_1.13), Interface (Converter_1.8)
3_P: MCU (RPI_3B+_1.15), Interface (Converter_1.7)
Net1_1: Module01 (1.1), FET_M1 (R18.1)
Net1_2: Module01 (1.2), FET_M1 (R26.1)
Net1_3: Module01 (1.3), FET_M1 (R20.1)
Net1_4: Module01 (1.4), FET_M1 (R28.1)
Net1_5: Module01 (1.5), FET_M1 (R22.1)
Net1_6: Module01 (1.6), FET_M1 (R30.1)
Net1_7: Module01 (1.7), FET_M1 (R24.1)
Net1_12: Module01 (1.12 2.12 3.12), MCU (RPI_3B+_1.16)
Net2_1: Module01 (2.1), FET_M1 (R32.1)
Net2_2: Module01 (2.2), FET_M1 (R34.1)
Net2_3: Module01 (2.3), FET_M1 (R42.1)
Net2_4: Module01 (2.4), FET_M1 (R36.1)
Net2_5: Module01 (2.5), FET_M1 (R44.1)
Net2_6: Module01 (2.6), FET_M1 (R38.1)
Net2_7: Module01 (2.7), FET_M1 (R46.1)
Net3_1: Module01 (3.1), FET_M1 (R40.1)
Net3_2: Module01 (3.2), FET_M1 (R48.1)
Net3_3: Module01 (3.3), FET_M1 (R50.1)
Net3_4: Module01 (3.4), FET_M1 (R54.1)
Net3_5: Module01 (3.5), FET_M1 (R52.1)
Net3_6: Module01 (3.6), FET_M1 (R56.1)
Net4_1: Module02 (4.1), FET_M2 (R96.1)
Net4_2: Module02 (4.2), FET_M2 (R90.1)
Net4_3: Module02 (4.3), FET_M2 (R81.1)
Net4_4: Module02 (4.4), FET_M2 (R77.1)
Net4_5: Module02 (4.5), FET_M2 (R97.1)
Net4_6: Module02 (4.6), FET_M2 (R93.1)
Net4_12: Module02 (4.12 5.12 6.12), MCU (RPI_3B+_1.21)
Net5_1: Module02 (5.1), FET_M2 (R71.1)
Net5_2: Module02 (5.2), FET_M2 (R95.1)
Net5_3: Module02 (5.3), FET_M2 (R87.1)
Net5_4: Module02 (5.4), FET_M2 (R105.1)
Net5_5: Module02 (5.5), FET_M2 (R103.1)
Net5_6: Module02 (5.6), FET_M2 (R80.1)
Net5_7: Module02 (5.7), FET_M2 (R74.1)
Net6_1: Module02 (6.1), FET_M2 (R78.1)
Net6_2: Module02 (6.2), FET_M2 (R68.1)
Net6_3: Module02 (6.3), FET_M2 (R94.1)
Net6_4: Module02 (6.4), FET_M2 (R84.1)
Net6_5: Module02 (6.5), FET_M2 (R104.1)
Net6_6: Module02 (6.6), FET_M2 (R100.1)
Net6_7: Module02 (6.7), FET_M2 (R79.1)
Net*1_1: Module01 (19 pins), GPIO_M1 (20 pins)
Net*31_1: FET_M1 (FET2.2), GPIO_M1 (*31.1 *31.2)
Net*32_1: FET_M1 (FET12.2), GPIO_M1 (*32.1 *32.2)
Net*43_1: FET_M1 (FET4.2), GPIO_M1 (*43.1 *43.2)
Net*44_1: FET_M1 (FET14.2), GPIO_M1 (*44.1 *44.2)
Net*55_1: FET_M1 (FET6.2), GPIO_M1 (*55.1 *55.2)
Net*56_1: FET_M1 (FET16.2), GPIO_M1 (*56.1 *56.2)
Net*67_1: FET_M1 (FET8.2), GPIO_M1 (*67.1 *67.2)
Net*68_1: FET_M1 (FET18.2), GPIO_M1 (*68.1 *68.2)
Net*79_1: FET_M1 (FET10.2), GPIO_M1 (*79.1 *79.2)
Net*80_1: FET_M1 (FET20.2), GPIO_M1 (*80.1 *80.2)
Net*81_1: Module02 (19 pins), GPIO_M2 (20 pins)
Net*106_1: FET_M2 (FET22.2), GPIO_M2 (*106.1 *106.2)
Net*112_1: FET_M2 (FET30.2), GPIO_M2 (*112.1 *112.2)
Net*118_1: FET_M2 (FET38.2), GPIO_M2 (*118.1 *118.2)
Net*124_1: FET_M2 (FET24.2), GPIO_M2 (*124.1 *124.2)
Net*130_1: FET_M2 (FET32.2), GPIO_M2 (*130.1 *130.2)
Net*136_1: FET_M2 (FET40.2), GPIO_M2 (*136.1 *136.2)
Net*142_1: FET_M2 (FET26.2), GPIO_M2 (*142.1 *142.2)
Net*148_1: FET_M2 (FET34.2), GPIO_M2 (*148.1 *148.2)
Net*154_1: FET_M2 (FET28.2), GPIO_M2 (*154.1 *154.2)
Net*160_1: FET_M2 (FET36.2), GPIO_M2 (*160.1 *160.2)
NetConverter_1_11: MCU (RPI_3B+_1.11), Interface (Converter_1.11)
NetInterface_Connector_9: MCU (RPI_3B+_1.3 RTC1.2), Interface (Interface_Connector.9)
NetInterface_Connector_19: MCU (RPI_3B+_1.5 RTC1.1), Interface (Interface_Connector.19)
NetInterface_Connector_20: MCU (RPI_3B+_1.7), Interface (Interface_Connector.20)
SOLENOID01: FET_M1 (FET1.2), GPIO_M1 (5 pins)
SOLENOID02: FET_M1 (FET3.2), GPIO_M1 (5 pins)
SOLENOID03: FET_M1 (FET5.2), GPIO_M1 (5 pins)
SOLENOID04: FET_M1 (FET7.2), GPIO_M1 (5 pins)
SOLENOID05: FET_M1 (FET9.2), GPIO_M1 (5 pins)
SOLENOID06: FET_M1 (FET11.2), GPIO_M1 (5 pins)
SOLENOID07: FET_M1 (FET13.2), GPIO_M1 (5 pins)
SOLENOID08: FET_M1 (FET15.2), GPIO_M1 (5 pins)
SOLENOID09: FET_M1 (FET17.2), GPIO_M1 (5 pins)
SOLENOID10: FET_M1 (FET19.2), GPIO_M1 (5 pins)
SOLENOID11: FET_M2 (FET21.2), GPIO_M2 (5 pins)
SOLENOID12: FET_M2 (FET29.2), GPIO_M2 (5 pins)
SOLENOID13: FET_M2 (FET37.2), GPIO_M2 (5 pins)
SOLENOID14: FET_M2 (FET23.2), GPIO_M2 (5 pins)
SOLENOID15: FET_M2 (FET31.2), GPIO_M2 (5 pins)
SOLENOID16: FET_M2 (FET39.2), GPIO_M2 (5 pins)
SOLENOID17: FET_M2 (FET25.2), GPIO_M2 (5 pins)
SOLENOID18: FET_M2 (FET33.2), GPIO_M2 (5 pins)
SOLENOID19: FET_M2 (FET27.2), GPIO_M2 (5 pins)
SOLENOID20: FET_M2 (FET35.2), GPIO_M2 (5 pins)